# EAGLE design daughter_board10 (EAGLE 7.5.0)

## Sheet 1 of 4
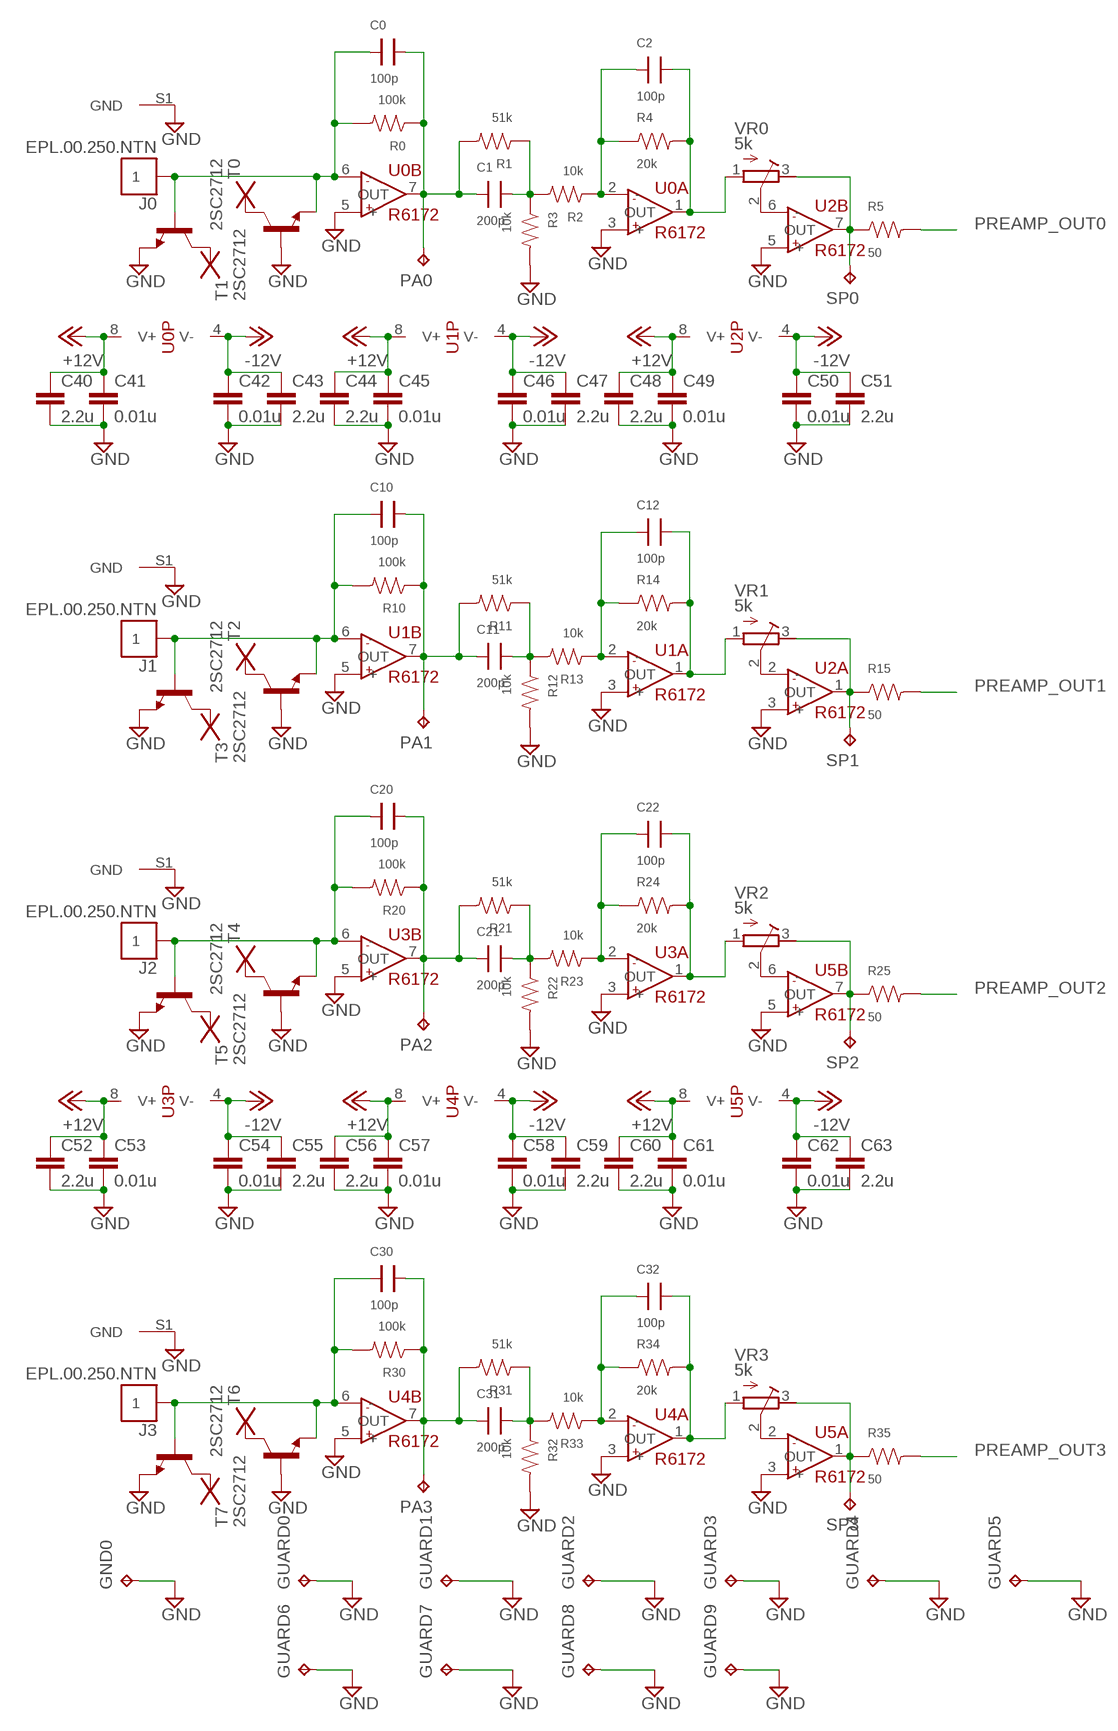
[diagram p0: schematic, sheet 1]

### Parts
C0  100p  C1608  [C0603]
C1  200p  C1608  [C0603]
C2  100p  C1608  [C0603]
C10  100p  C1608  [C0603]
C11  200p  C1608  [C0603]
C12  100p  C1608  [C0603]
C20  100p  C1608  [C0603]
C21  200p  C1608  [C0603]
C22  100p  C1608  [C0603]
C30  100p  C1608  [C0603]
C31  200p  C1608  [C0603]
C32  100p  C1608  [C0603]
C40  2.2u  C-EUC3216  [C3216]
C41  0.01u  C-EUC1608  [C1608]
C42  0.01u  C-EUC1608  [C1608]
C43  2.2u  C-EUC3216  [C3216]
C44  2.2u  C-EUC3216  [C3216]
C45  0.01u  C-EUC1608  [C1608]
C46  0.01u  C-EUC1608  [C1608]
C47  2.2u  C-EUC3216  [C3216]
C48  2.2u  C-EUC3216  [C3216]
C49  0.01u  C-EUC1608  [C1608]
C50  0.01u  C-EUC1608  [C1608]
C51  2.2u  C-EUC3216  [C3216]
C52  2.2u  C-EUC3216  [C3216]
C53  0.01u  C-EUC1608  [C1608]
C54  0.01u  C-EUC1608  [C1608]
C55  2.2u  C-EUC3216  [C3216]
C56  2.2u  C-EUC3216  [C3216]
C57  0.01u  C-EUC1608  [C1608]
C58  0.01u  C-EUC1608  [C1608]
C59  2.2u  C-EUC3216  [C3216]
C60  2.2u  C-EUC3216  [C3216]
C61  0.01u  C-EUC1608  [C1608]
C62  0.01u  C-EUC1608  [C1608]
C63  2.2u  C-EUC3216  [C3216]
GND0  TPPAD1-13  [P1-13]
GUARD0  TPTP17SQ  [TP17SQ]
GUARD1  TPTP17SQ  [TP17SQ]
GUARD2  TPTP17SQ  [TP17SQ]
GUARD3  TPTP17SQ  [TP17SQ]
GUARD4  TPTP17SQ  [TP17SQ]
GUARD5  TPTP17SQ  [TP17SQ]
GUARD6  TPTP17SQ  [TP17SQ]
GUARD7  TPTP17SQ  [TP17SQ]
GUARD8  TPTP17SQ  [TP17SQ]
GUARD9  TPTP17SQ  [TP17SQ]
J0  EPL.00.250.NTN  [EPL.00.250.NTN]
J1  EPL.00.250.NTN  [EPL.00.250.NTN]
J2  EPL.00.250.NTN  [EPL.00.250.NTN]
J3  EPL.00.250.NTN  [EPL.00.250.NTN]
PA0  TPPAD1-13  [P1-13]
PA1  TPPAD1-13  [P1-13]
PA2  TPPAD1-13  [P1-13]
PA3  TPPAD1-13  [P1-13]
R0  100k  R1608  [R0603]
R1  51k  R1608  [R0603]
R2  10k  R1608  [R0603]
R3  10k  R1608  [R0603]
R4  20k  R1608  [R0603]
R5  50  R1608  [R0603]
R10  100k  R1608  [R0603]
R11  51k  R1608  [R0603]
R12  10k  R1608  [R0603]
R13  10k  R1608  [R0603]
R14  20k  R1608  [R0603]
R15  50  R1608  [R0603]
R20  100k  R1608  [R0603]
R21  51k  R1608  [R0603]
R22  10k  R1608  [R0603]
R23  10k  R1608  [R0603]
R24  20k  R1608  [R0603]
R25  50  R1608  [R0603]
R30  100k  R1608  [R0603]
R31  51k  R1608  [R0603]
R32  10k  R1608  [R0603]
R33  10k  R1608  [R0603]
R34  20k  R1608  [R0603]
R35  50  R1608  [R0603]
SP0  TPPAD1-13  [P1-13]
SP1  TPPAD1-13  [P1-13]
SP2  TPPAD1-13  [P1-13]
SP3  TPPAD1-13  [P1-13]
T0  2SC2712  BC808-NPN-SOT23-BEC  [SOT23-BEC]
T1  2SC2712  BC808-NPN-SOT23-BEC  [SOT23-BEC]
T2  2SC2712  BC808-NPN-SOT23-BEC  [SOT23-BEC]
T3  2SC2712  BC808-NPN-SOT23-BEC  [SOT23-BEC]
T4  2SC2712  BC808-NPN-SOT23-BEC  [SOT23-BEC]
T5  2SC2712  BC808-NPN-SOT23-BEC  [SOT23-BEC]
T6  2SC2712  BC808-NPN-SOT23-BEC  [SOT23-BEC]
T7  2SC2712  BC808-NPN-SOT23-BEC  [SOT23-BEC]
U0  R6172  LM6172SOIC(D)8  [SOP8]
U1  R6172  LM6172SOIC(D)8  [SOP8]
U2  R6172  LM6172SOIC(D)8  [SOP8]
U3  R6172  LM6172SOIC(D)8  [SOP8]
U4  R6172  LM6172SOIC(D)8  [SOP8]
U5  R6172  LM6172SOIC(D)8  [SOP8]
U$22  NC  (no package)
U$23  NC  (no package)
U$24  NC  (no package)
U$25  NC  (no package)
U$26  NC  (no package)
U$27  NC  (no package)
U$28  NC  (no package)
U$29  NC  (no package)
VR0  5k  R-TRIMM3296W  [RTRIM3296W]
VR1  5k  R-TRIMM3296W  [RTRIM3296W]
VR2  5k  R-TRIMM3296W  [RTRIM3296W]
VR3  5k  R-TRIMM3296W  [RTRIM3296W]

### Nets
+12V: C40.1 C41.1 C44.1 C45.1 C48.1 C49.1 C52.1 C53.1 C56.1 C57.1 C60.1 C61.1 U0.8(P:V+) U1.8(P:V+) U2.8(P:V+) U3.8(P:V+) U4.8(P:V+) U5.8(P:V+) ; also sheet 2,4
-12V: C42.1 C43.1 C46.1 C47.1 C50.1 C51.1 C54.1 C55.1 C58.1 C59.1 C62.1 C63.1 U0.4(P:V-) U1.4(P:V-) U2.4(P:V-) U3.4(P:V-) U4.4(P:V-) U5.4(P:V-) ; also sheet 2,4
GND: C40.2 C41.2 C42.2 C43.2 C44.2 C45.2 C46.2 C47.2 C48.2 C49.2 C50.2 C51.2 C52.2 C53.2 C54.2 C55.2 C56.2 C57.2 C58.2 C59.2 C60.2 C61.2 C62.2 C63.2 GND0.TP GUARD0.TP GUARD1.TP GUARD2.TP GUARD3.TP GUARD4.TP GUARD5.TP GUARD6.TP GUARD7.TP GUARD8.TP GUARD9.TP J0.S1(GND) J1.S1(GND) J2.S1(GND) J3.S1(GND) R3.2 R12.2 R22.2 R32.2 T0.E T1.B T2.E T3.B T4.E T5.B T6.E T7.B U0.3(A:+) U0.5(B:+) U1.3(A:+) U1.5(B:+) U2.3(A:+) U2.5(B:+) U3.3(A:+) U3.5(B:+) U4.3(A:+) U4.5(B:+) U5.3(A:+) U5.5(B:+) ; also sheet 2,3,4
N$2: C0.1 J0.1 R0.2 T0.B T1.E U0.6(B:-)
N$4: C0.2 C1.1 PA0.TP R0.1 R1.2 U0.7(B:OUT)
N$5: U2.6(B:-) VR0.2(S)
N$6: C1.2 R1.1 R2.2 R3.1
N$7: C2.1 R2.1 R4.1 U0.2(A:-)
N$8: C2.2 R4.2 U0.1(A:OUT) VR0.1(A)
N$9: R5.1 SP0.TP U2.7(B:OUT) VR0.3(E)
N$10: C10.1 J1.1 R10.2 T2.B T3.E U1.6(B:-)
N$11: C10.2 C11.1 PA1.TP R10.1 R11.2 U1.7(B:OUT)
N$12: C11.2 R11.1 R12.1 R13.2
N$13: C12.1 R13.1 R14.1 U1.2(A:-)
N$14: C12.2 R14.2 U1.1(A:OUT) VR1.1(A)
N$17: U2.2(A:-) VR1.2(S)
N$18: R15.1 SP1.TP U2.1(A:OUT) VR1.3(E)
N$20: C20.2 C21.1 PA2.TP R20.1 R21.2 U3.7(B:OUT)
N$21: C21.2 R21.1 R22.1 R23.2
N$22: C22.1 R23.1 R24.1 U3.2(A:-)
N$23: C22.2 R24.2 U3.1(A:OUT) VR2.1(A)
N$24: C20.1 J2.1 R20.2 T4.B T5.E U3.6(B:-)
N$26: U5.6(B:-) VR2.2(S)
N$27: R25.1 SP2.TP U5.7(B:OUT) VR2.3(E)
N$28: C30.1 J3.1 R30.2 T6.B T7.E U4.6(B:-)
N$29: C30.2 C31.1 PA3.TP R30.1 R31.2 U4.7(B:OUT)
N$30: C31.2 R31.1 R32.1 R33.2
N$31: C32.1 R33.1 R34.1 U4.2(A:-)
N$32: C32.2 R34.2 U4.1(A:OUT) VR3.1(A)
N$35: U5.2(A:-) VR3.2(S)
N$36: R35.1 SP3.TP U5.1(A:OUT) VR3.3(E)
N$71: T0.C U$22.NC
N$72: T1.C U$23.NC
N$74: T3.C U$24.NC
N$75: T2.C U$25.NC
N$76: T4.C U$26.NC
N$77: T5.C U$27.NC
N$78: T6.C U$28.NC
N$79: T7.C U$29.NC
PREAMP_OUT0: R5.2 ; also sheet 3
PREAMP_OUT1: R15.2 ; also sheet 3
PREAMP_OUT2: R25.2 ; also sheet 3
PREAMP_OUT3: R35.2 ; also sheet 3

## Sheet 2 of 4
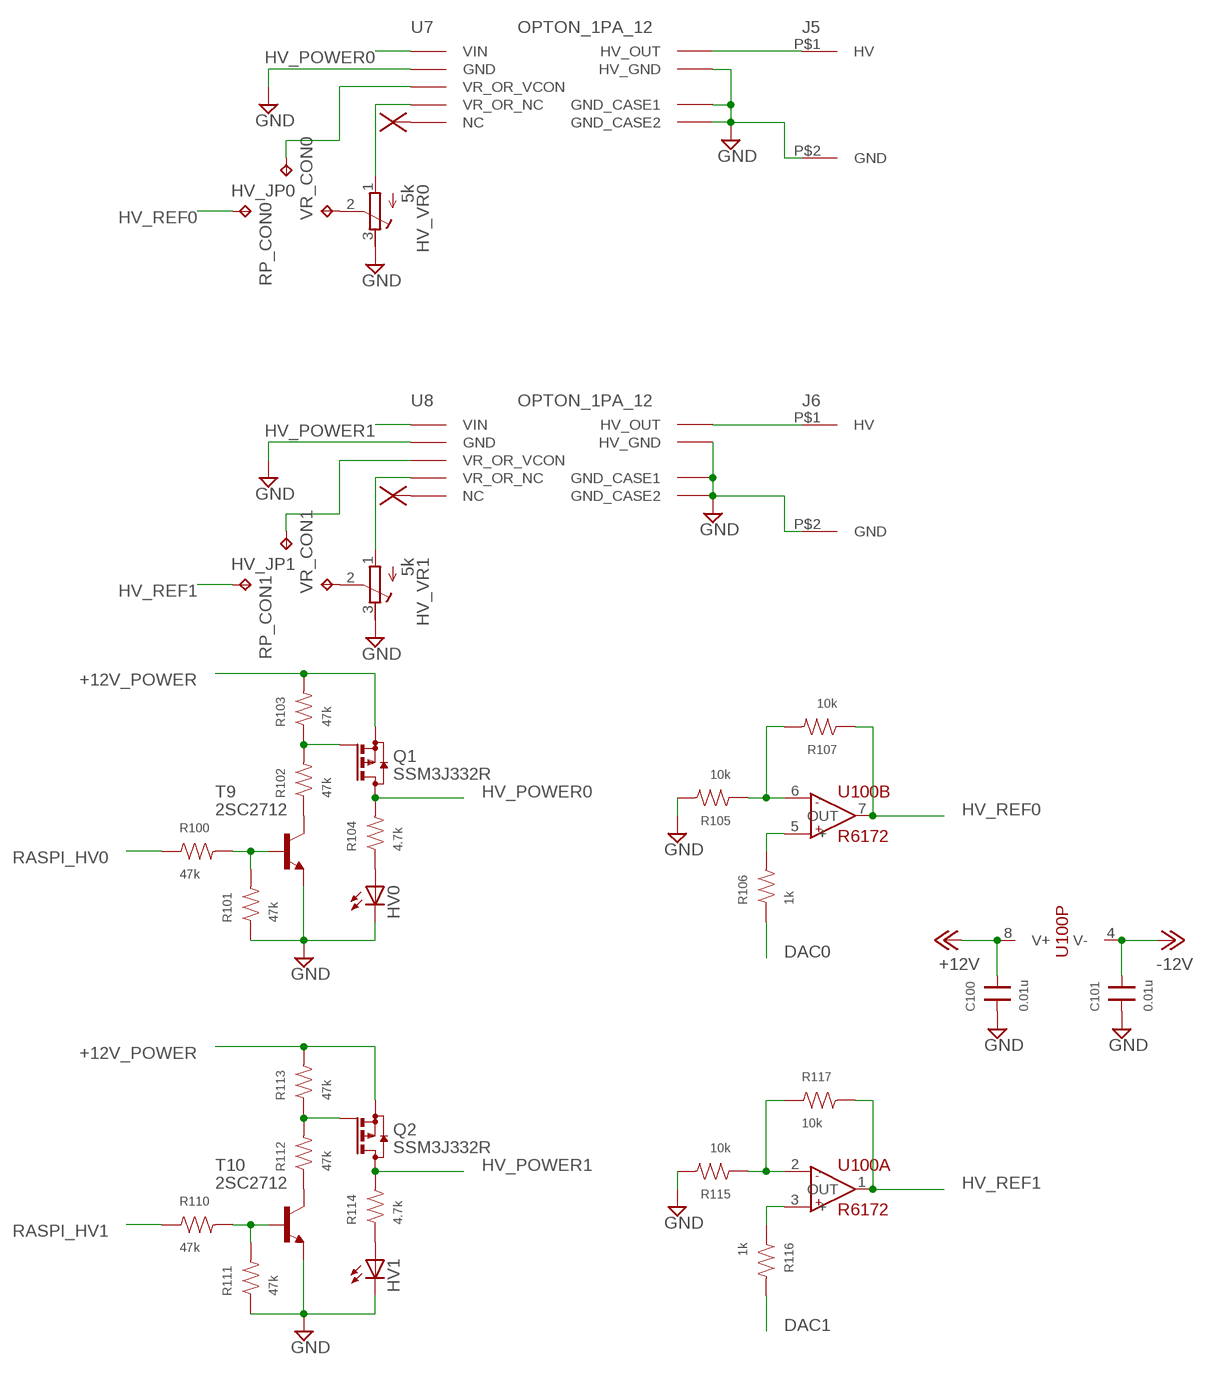
[diagram p1: schematic, sheet 2]

### Parts
C100  0.01u  C1608  [C0603]
C101  0.01u  C1608  [C0603]
HV0  LED_1608  [LED_1608]
HV1  LED_1608  [LED_1608]
HV_JP0  TPPAD1-13  [P1-13]
HV_JP1  TPPAD1-13  [P1-13]
HV_VR0  5k  R-TRIMM3296W  [RTRIM3296W]
HV_VR1  5k  R-TRIMM3296W  [RTRIM3296W]
J5  SHV_PIGTAIL_LAND  [SHV_PIGTAIL_LAND]
J6  SHV_PIGTAIL_LAND  [SHV_PIGTAIL_LAND]
Q1  SSM3J332R  BSS84  [SOT23]
Q2  SSM3J332R  BSS84  [SOT23]
R100  47k  R1608  [R0603]
R101  47k  R1608  [R0603]
R102  47k  R1608  [R0603]
R103  47k  R1608  [R0603]
R104  4.7k  R1608  [R0603]
R105  10k  R1608  [R0603]
R106  1k  R1608  [R0603]
R107  10k  R1608  [R0603]
R110  47k  R1608  [R0603]
R111  47k  R1608  [R0603]
R112  47k  R1608  [R0603]
R113  47k  R1608  [R0603]
R114  4.7k  R1608  [R0603]
R115  10k  R1608  [R0603]
R116  1k  R1608  [R0603]
R117  10k  R1608  [R0603]
RP_CON0  TPPAD1-13  [P1-13]
RP_CON1  TPPAD1-13  [P1-13]
T9  2SC2712  BC808-NPN-SOT23-BEC  [SOT23-BEC]
T10  2SC2712  BC808-NPN-SOT23-BEC  [SOT23-BEC]
U7  OPTON_1PA_12  [OPTON_PA]
U8  OPTON_1PA_12  [OPTON_PA]
U100  R6172  LM6172SOIC(D)8  [SOP8]
U$6  NC  (no package)
U$9  NC  (no package)
VR_CON0  TPPAD1-13  [P1-13]
VR_CON1  TPPAD1-13  [P1-13]

### Nets
+12V: C100.2 U100.8(P:V+) ; also sheet 1,4
+12V_POWER: Q1.2(S) Q2.2(S) R103.2 R113.2 ; also sheet 3,4
-12V: C101.2 U100.4(P:V-) ; also sheet 1,4
DAC0: R106.1 ; also sheet 3
DAC1: R116.2 ; also sheet 3
GND: C100.1 C101.1 HV0.P$2(C) HV1.P$2(C) HV_VR0.3(E) HV_VR1.3(E) J5.P$2(GND) J6.P$2(GND) R101.1 R105.2 R111.1 R115.2 T9.E T10.E U7.P$2(GND) U7.P$6(HV_GND) U7.P$8(GND_CASE1) U7.P$9(GND_CASE2) U8.P$2(GND) U8.P$6(HV_GND) U8.P$8(GND_CASE1) U8.P$9(GND_CASE2) ; also sheet 1,3,4
HV_POWER0: Q1.3(D) R104.2 U7.P$1(VIN)
HV_POWER1: Q2.3(D) R114.2 U8.P$1(VIN)
HV_REF0: R107.1 RP_CON0.TP U100.7(B:OUT)
HV_REF1: R117.2 RP_CON1.TP U100.1(A:OUT)
N$37: R102.1 T9.C
N$38: Q1.1(G) R102.2 R103.1
N$39: R100.2 R101.2 T9.B
N$40: R112.1 T10.C
N$41: Q2.1(G) R112.2 R113.1
N$42: HV0.P$1(A) R104.1
N$43: R110.2 R111.2 T10.B
N$44: HV1.P$1(A) R114.1
N$45: R105.1 R107.2 U100.6(B:-)
N$46: J5.P$1(HV) U7.P$7(HV_OUT)
N$47: R106.2 U100.5(B:+)
N$48: J6.P$1(HV) U8.P$7(HV_OUT)
N$49: R115.1 R117.1 U100.2(A:-)
N$50: R116.1 U100.3(A:+)
N$55: HV_VR0.1(A) U7.P$4(VR_OR_NC)
N$56: U7.P$5(NC) U$6.NC
N$57: HV_VR1.2(S) VR_CON1.TP
N$59: U8.P$5(NC) U$9.NC
N$69: HV_VR0.2(S) VR_CON0.TP
N$73: HV_VR1.1(A) U8.P$4(VR_OR_NC)
RASPI_HV0: R100.1 ; also sheet 3
RASPI_HV1: R110.1 ; also sheet 3
TP1: HV_JP0.TP U7.P$3(VR_OR_VCON)
TP2: HV_JP1.TP U8.P$3(VR_OR_VCON)

## Sheet 3 of 4
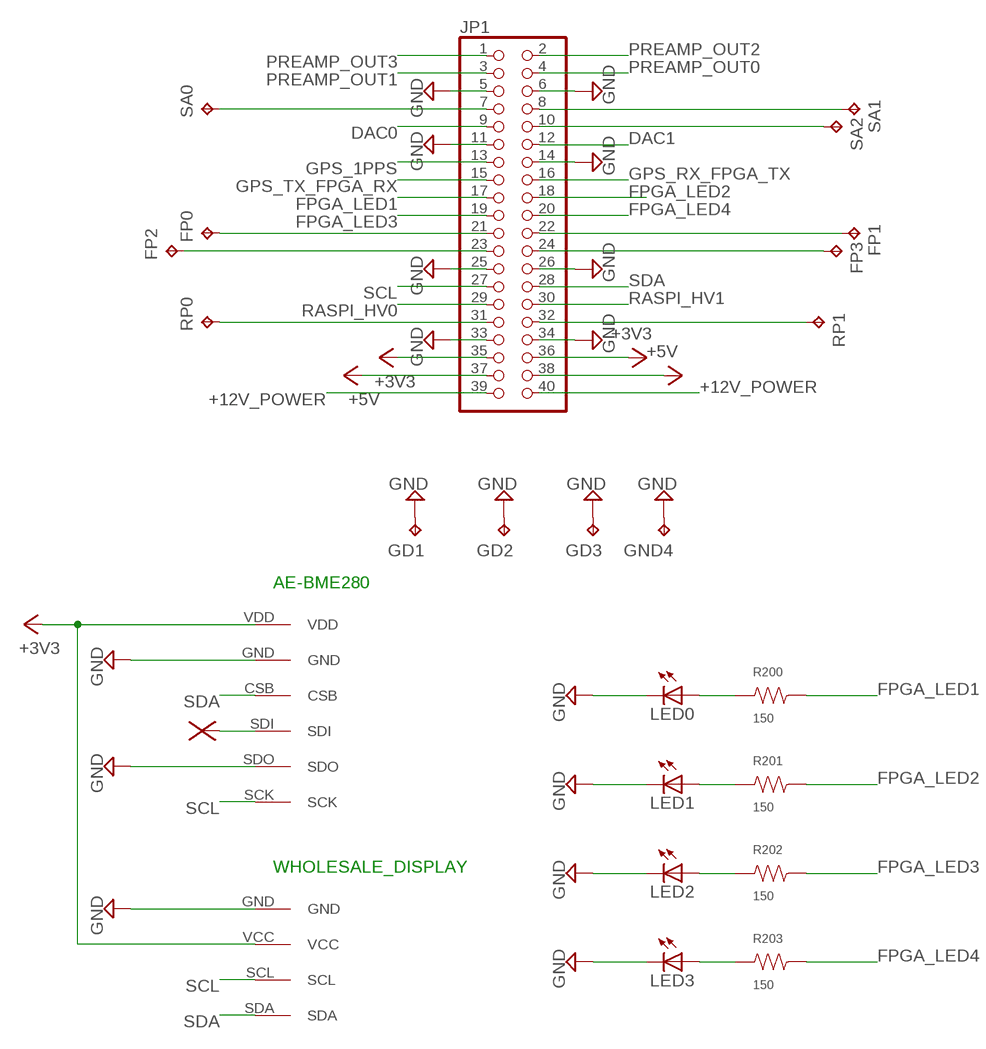
[diagram p2: schematic, sheet 3]

### Parts
FP0  TPPAD1-13  [P1-13]
FP1  TPPAD1-13  [P1-13]
FP2  TPPAD1-13  [P1-13]
FP3  TPPAD1-13  [P1-13]
GD1  TPPAD1-13  [P1-13]
GD2  TPPAD1-13  [P1-13]
GD3  TPPAD1-13  [P1-13]
GND4  TPPAD1-13  [P1-13]
JP1  PINHD-2X20  [2X20]
LED0  LED_1608  [LED_1608]
LED1  LED_1608  [LED_1608]
LED2  LED_1608  [LED_1608]
LED3  LED_1608  [LED_1608]
R200  150  R1608  [R0603]
R201  150  R1608  [R0603]
R202  150  R1608  [R0603]
R203  150  R1608  [R0603]
RP0  TPPAD1-13  [P1-13]
RP1  TPPAD1-13  [P1-13]
SA0  TPPAD1-13  [P1-13]
SA1  TPPAD1-13  [P1-13]
SA2  TPPAD1-13  [P1-13]
U$1  WHOLESALE_DISPLAY  [WHOLESALE_DISPLAY]
U$2  AE-BME280  [AE-BME280]
U$17  NC  (no package)

### Nets
+3V3: JP1.35 JP1.36 U$1.VCC U$2.VDD ; also sheet 4
+5V: JP1.37 JP1.38
+12V_POWER: JP1.39 JP1.40 ; also sheet 2,4
DAC0: JP1.9 ; also sheet 2
DAC1: JP1.12 ; also sheet 2
FPGA_LED1: JP1.17 R200.2
FPGA_LED2: JP1.18 R201.2
FPGA_LED3: JP1.19 R202.2
FPGA_LED4: JP1.20 R203.2
GND: GD1.TP GD2.TP GD3.TP GND4.TP JP1.5 JP1.6 JP1.11 JP1.14 JP1.25 JP1.26 JP1.33 JP1.34 LED0.P$2(C) LED1.P$2(C) LED2.P$2(C) LED3.P$2(C) U$1.GND U$2.GND U$2.SDO ; also sheet 1,2,4
GPS_1PPS: JP1.13 ; also sheet 4
GPS_RX_FPGA_TX: JP1.16 ; also sheet 4
GPS_TX_FPGA_RX: JP1.15 ; also sheet 4
LED0: LED0.P$1(A) R200.1
N$3: JP1.31 RP0.TP
N$15: FP2.TP JP1.23
N$16: FP0.TP JP1.21
N$19: JP1.7 SA0.TP
N$25: JP1.8 SA1.TP
N$33: JP1.10 SA2.TP
N$34: FP1.TP JP1.22
N$51: U$2.SDI U$17.NC
N$58: FP3.TP JP1.24
N$66: LED3.P$1(A) R203.1
N$67: LED2.P$1(A) R202.1
N$68: LED1.P$1(A) R201.1
N$70: JP1.32 RP1.TP
PREAMP_OUT0: JP1.4 ; also sheet 1
PREAMP_OUT1: JP1.3 ; also sheet 1
PREAMP_OUT2: JP1.2 ; also sheet 1
PREAMP_OUT3: JP1.1 ; also sheet 1
RASPI_HV0: JP1.29 ; also sheet 2
RASPI_HV1: JP1.30 ; also sheet 2
SCL: JP1.27 U$1.SCL U$2.SCK
SDA: JP1.28 U$1.SDA U$2.CSB

### Notes on the sheet
- AE-BME280
- WHOLESALE_DISPLAY

## Sheet 4 of 4
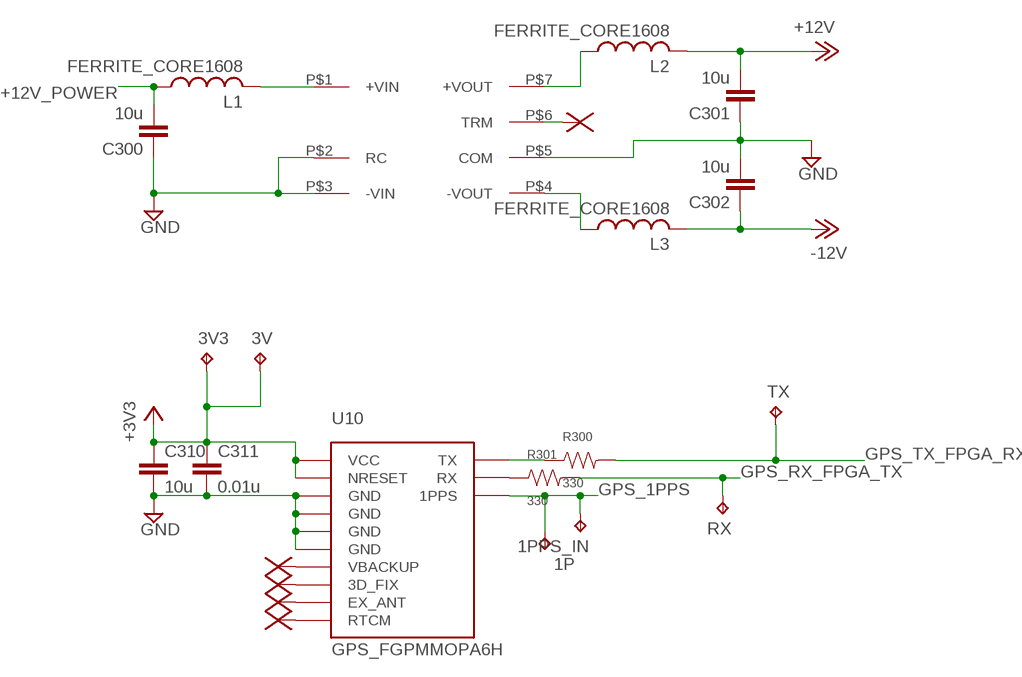
[diagram p3: schematic, sheet 4]

### Parts
1P  TPPAD1-13  [P1-13]
1PPS_IN  TPPAD1-13  [P1-13]
3V  TPPAD1-13  [P1-13]
3V3  TPPAD1-13  [P1-13]
C300  10u  C-EUC3216  [C3216]
C301  10u  C-EUC3216  [C3216]
C302  10u  C-EUC3216  [C3216]
C310  10u  C-EUC3216  [C3216]
C311  0.01u  C-EUC1608  [C1608]
L1  FERRITE_CORE1608  [R0603]
L2  FERRITE_CORE1608  [R0603]
L3  FERRITE_CORE1608  [R0603]
R300  330  R1608  [R0603]
R301  330  R1608  [R0603]
RX  TPPAD1-13  [P1-13]
TX  TPPAD1-13  [P1-13]
U10  GPS_FGPMMOPA6H  [GPS_FGPMMOPA6H]
U$4  CC6-SERIES  [CC6-SERIES]
U$18  NC  (no package)
U$19  NC  (no package)
U$20  NC  (no package)
U$21  NC  (no package)
U$30  NC  (no package)

### Nets
+3V3: 3V3.TP 3V.TP C310.1 C311.1 U10.P$1(VCC) U10.P$2(NRESET) ; also sheet 3
+12V: C301.2 L2.2 ; also sheet 1,2
+12V_POWER: C300.2 L1.1 ; also sheet 2,3
-12V: C302.1 L3.2 ; also sheet 1,2
GND: C300.1 C301.1 C302.2 C310.2 C311.2 U10.P$3(GND) U10.P$8(GND) U10.P$12(GND) U10.P$19(GND) U$4.P$2(RC) U$4.P$3(-VIN) U$4.P$5(COM) ; also sheet 1,2,3
GPS_1PPS: 1P.TP 1PPS_IN.TP U10.P$13(1PPS) ; also sheet 3
GPS_RX_FPGA_TX: R301.2 RX.TP ; also sheet 3
GPS_TX_FPGA_RX: R300.2 TX.TP ; also sheet 3
N$1: U$4.P$6(TRM) U$30.NC
N$52: L2.1 U$4.P$7(+VOUT)
N$53: L3.1 U$4.P$4(-VOUT)
N$54: L1.2 U$4.P$1(+VIN)
N$60: U10.P$4(VBACKUP) U$18.NC
N$61: U10.P$5(3D_FIX) U$19.NC
N$62: U10.P$11(EX_ANT) U$20.NC
N$63: U10.P$14(RTCM) U$21.NC
N$64: R301.1 U10.P$10(RX)
N$65: R300.1 U10.P$9(TX)

## Library data of the parts
1P 1PPS_IN 3V 3V3 FP0 FP1-FP3 GD1-GD3 GND0 GND4 GUARD0 GUARD1-GUARD9 HV_JP0 HV_JP1 PA0 PA1-PA3 RP0 RP1 RP_CON0 RP_CON1 RX SA0 SA1 SA2 SP0 SP1-SP3 TX VR_CON0 VR_CON1 = Aardvark:TP: Test pad
C0 C1 C2 C10-C12 C20-C22 C30-C32 C100 C101 = Aardvark:C1608: SMC Capacitor 1608 (0603)
C40-C63 = resistor:C-EU: CAPACITOR, European symbol
C300-C302 C310 C311 = rcl:C-EU: CAPACITOR, European symbol
HV0 HV1 LED0 LED1-LED3 = Aardvark:LED_1608: SMD LED datasheet <http://docs-asia.electrocomponents.com/webdocs/1020/0900766b81020b31.pdf> -------------------------- 色: V 1608 SML-310VTT86 (Vf=2.0V I_F=20mA) RS: 700-7926 <http://jp.rs-online.com/web/p/visible-leds/7007926/> 15円/個 20個単位 -------------------------- 色: 黄色 SML-311WTT86 (Vf=1.8 I_F=2mA) RS: 752-6789 <http://jp.rs-online.com/web/p/visible-leds/7526789/> 11.5円/個 10個単位
HV_VR0 HV_VR1 VR0 VR1-VR3 = resistor:R-TRIMM: Trimm resistor
J0 J1-J3 = Aardvark:EPL.00.250.NTN: LEMO Connector Elbow receptacle for printed circuit Source: http://intra.lemo.ch/catalog/ROW/UK_English/00and01Coaxial_en.pdf RS: Right angle: http://jp.rs-online.com/web/p/coaxial-plugs-sockets/1248635/ Straight1: http://jp.rs-online.com/web/p/coaxial-plugs-sockets/1243371/ Straight2: http://jp.rs-online.com/web/p/coaxial-plugs-sockets/1248629/; MPN: EPL.00.250.NTN; OC_FARNELL: 3817866; OC_NEWARK: 25R7486; PACKAGE: Through Hole; SUPPLIER: LEMO
J5 J6 = Aardvark:SHV_PIGTAIL_LAND
JP1 = Aardvark:PINHD-2X20: PIN HEADER
L1-L3 = Aardvark:FERRITE_CORE1608
Q1 Q2 = transistor-small-signal:BSS84: P-CHANNEL MOS FET
R0 R1-R5 R10-R15 R20-R25 R30-R35 R100-R107 R110-R117 R200-R203 R300 R301 = Aardvark:R1608: SMD Resistor 1608 (0603)
T0 T1-T7 = transistor-neu-to92:*-NPN-: NPN Transistror BF959 corrected 2008.03.06
T9 T10 = transistor:*-NPN-: NPN Transistror BF959 corrected 2008.03.06
U0 U1-U5 U100 = OPA:LM6172: TEXAS INSTRUMENTS Dual High Speed, Low Power, Low Distortion, Voltage Feedback Amplifier LM6172 <http://www.ti.com/lit/ds/symlink/lm6172.pdf>
U7 U8 = Aardvark:OPTON_1PA_12
U10 = Aardvark:GPS_FGPMMOPA6H: GPS FGPMMOPA6H MT3339 TTL -165dBm Integration Of Antenna Module https://www.adafruit.com/datasheets/GlobalTop-FGPMMOPA6H-Datasheet-V0A.pdf
U$1 = Aardvark:WHOLESALE_DISPLAY
U$2 = Aardvark:AE-BME280
U$4 = Aardvark:CC6-SERIES: DC-DC コンバータ CC6-xxxxxR-E シリーズ
U$6 U$9 U$17-U$30 = Aardvark:NC

## Board
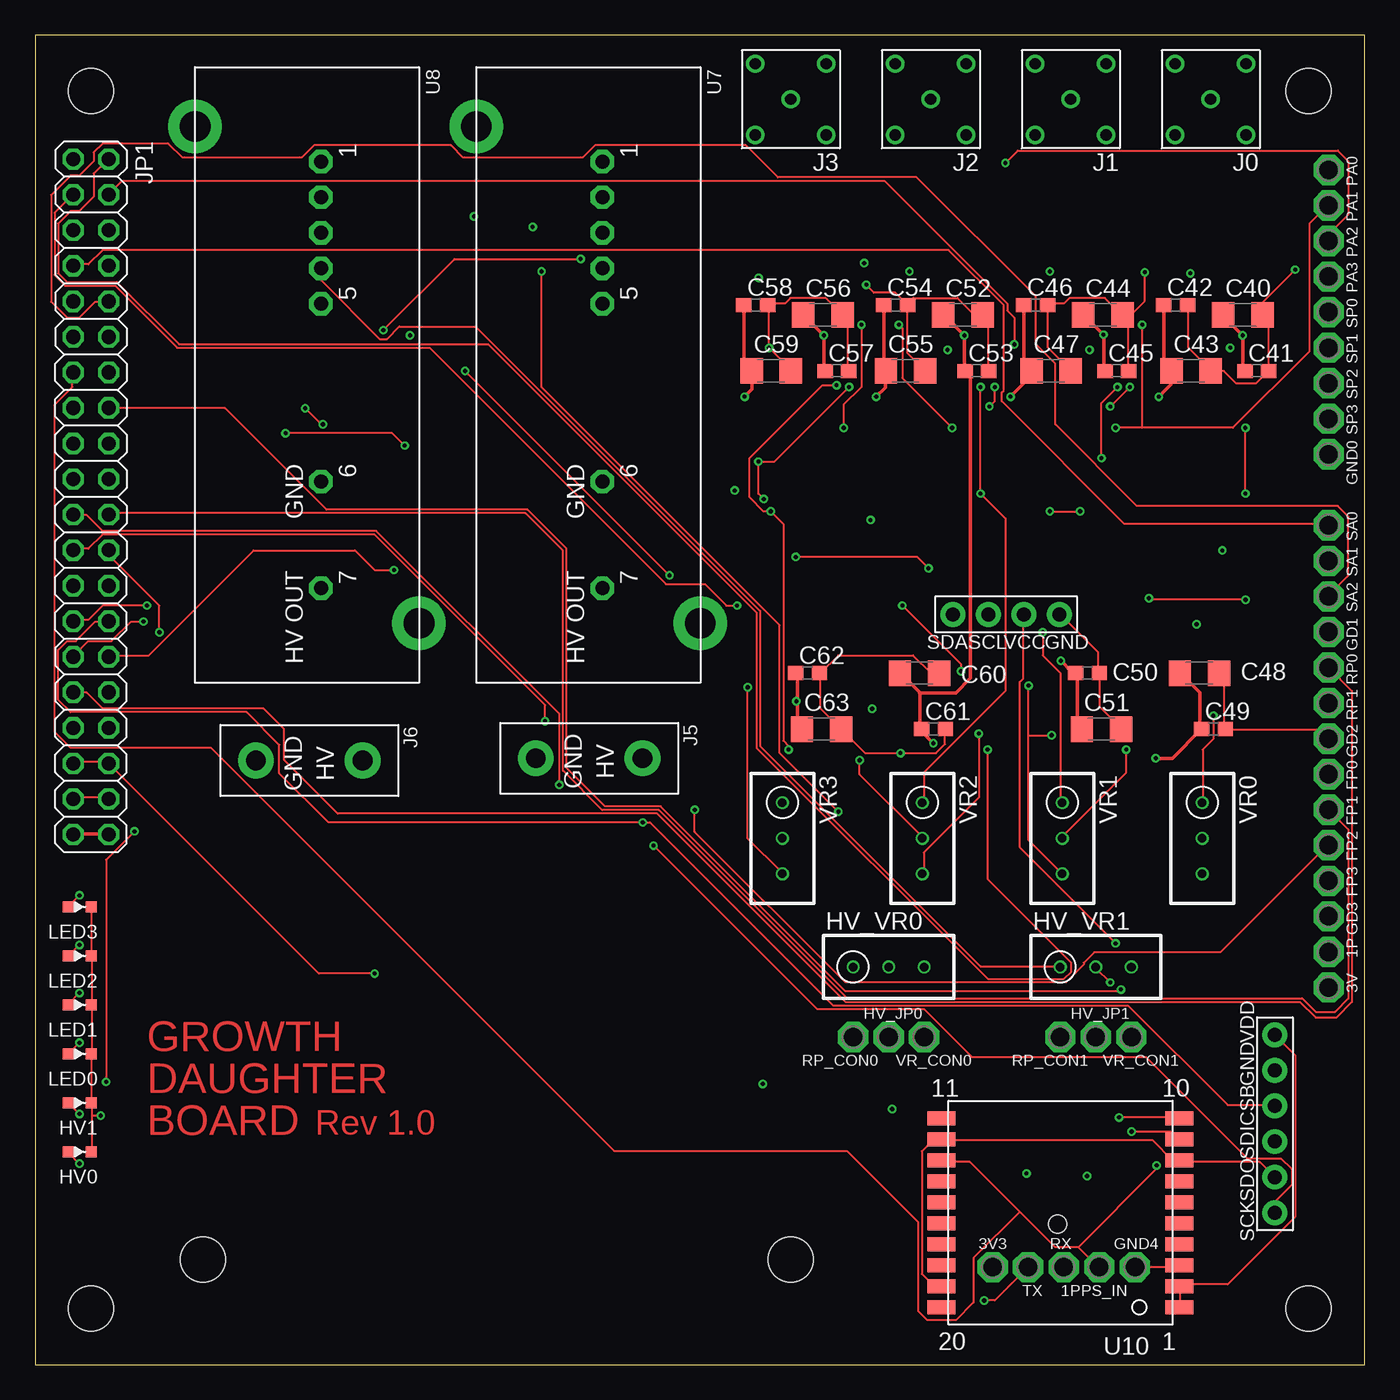
[diagram p4: board, top side]
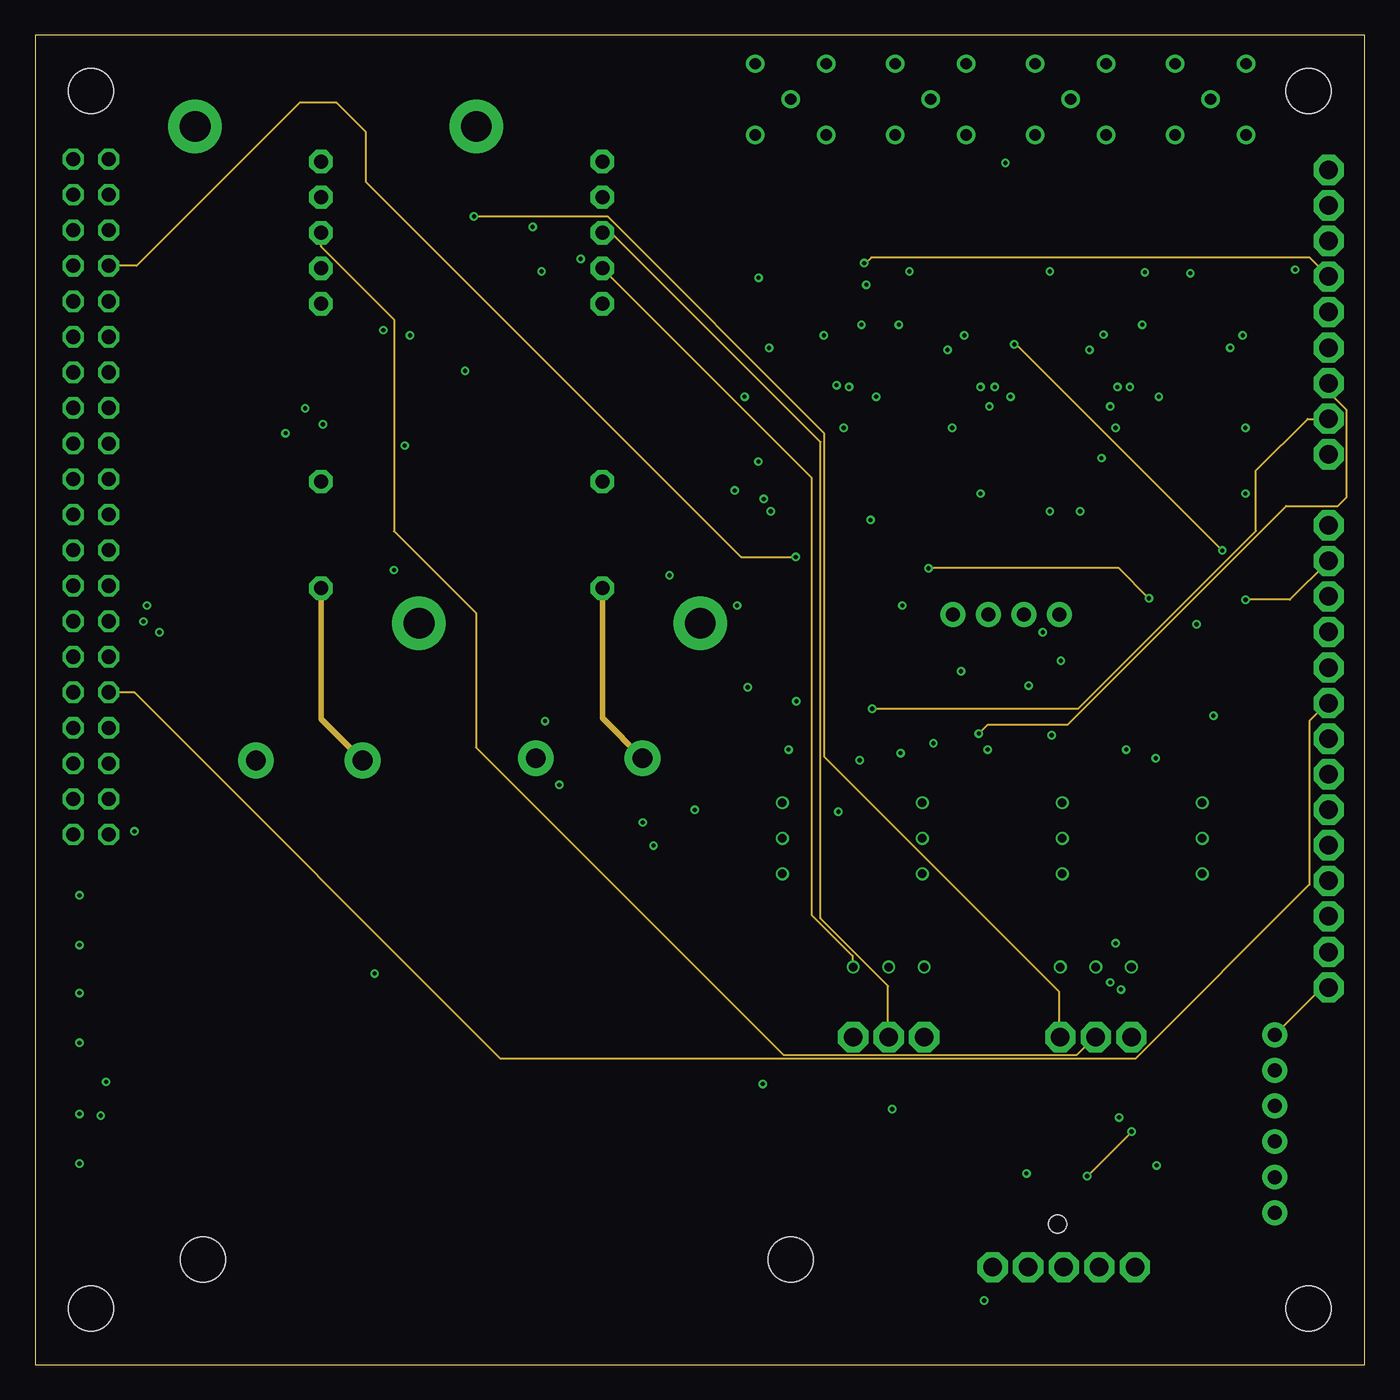
[diagram p5: board, inner layer Route2]
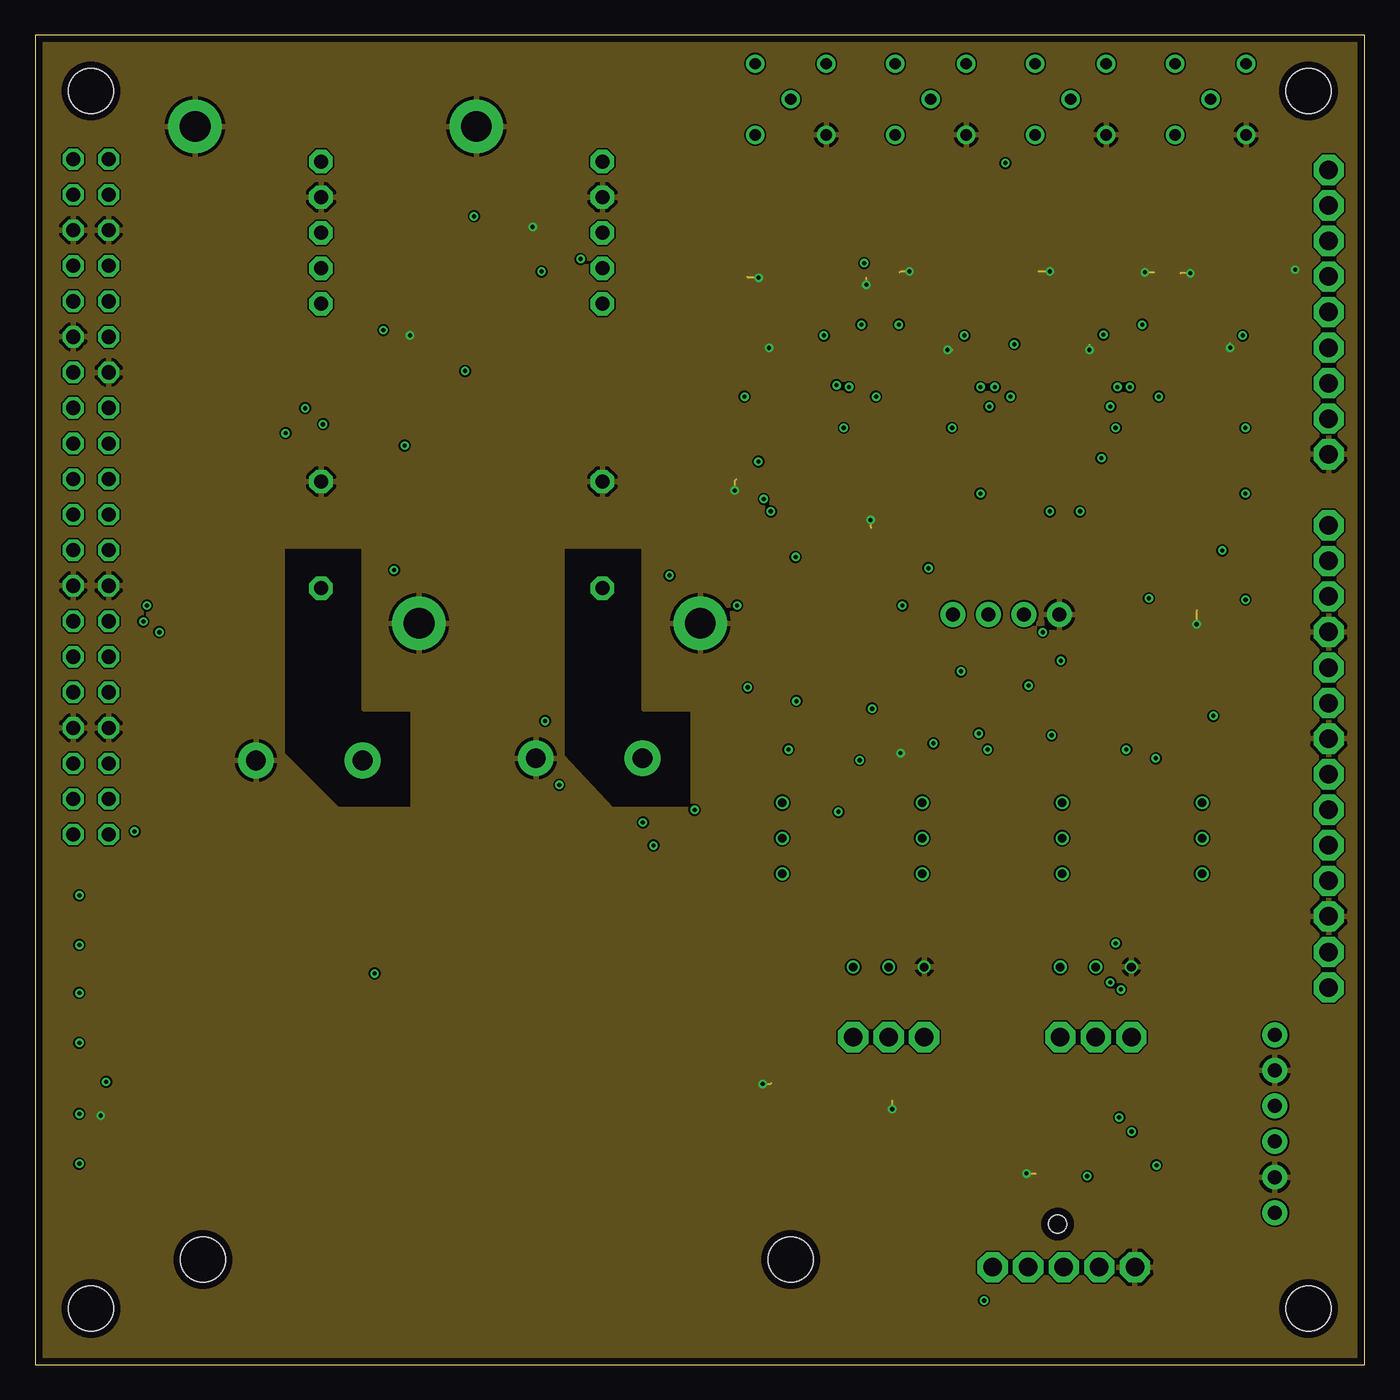
[diagram p6: board, inner layer Route15]
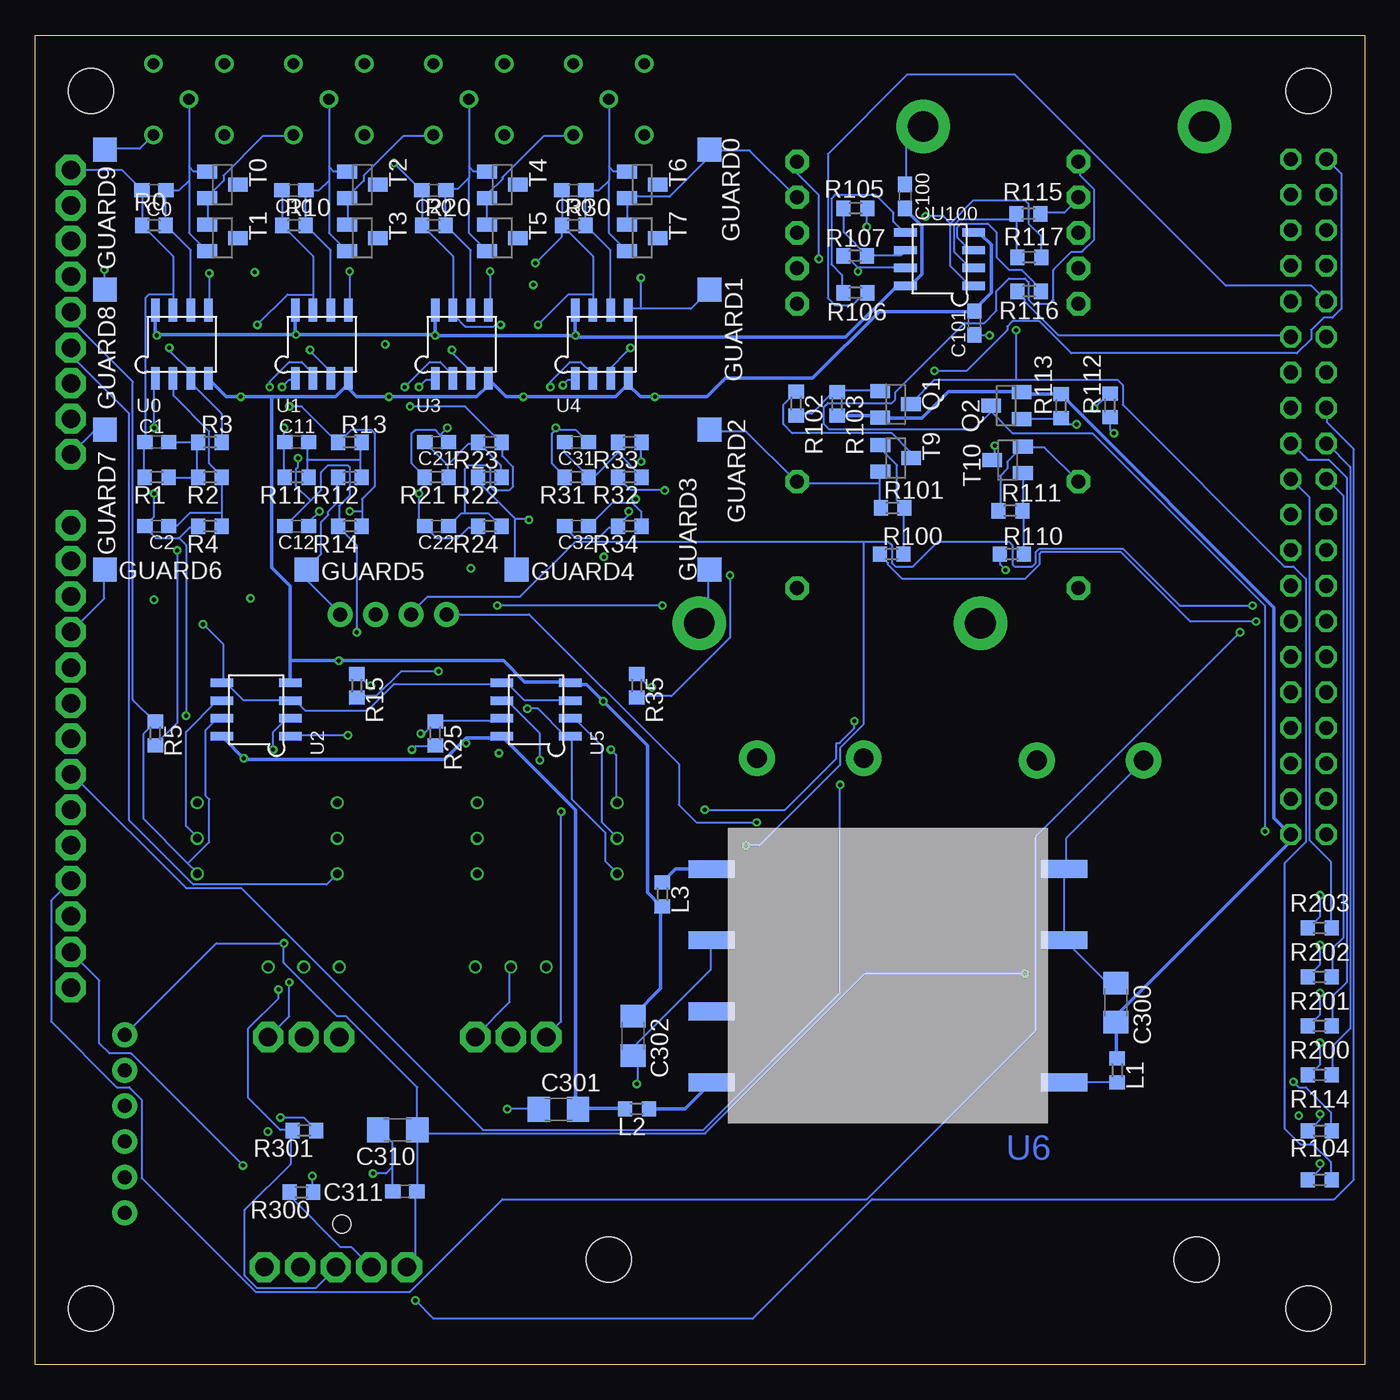
[diagram p7: board, bottom side, seen from below]

Size 95 x 95 mm. Coordinates in mm from the lower left corner, seen from the top.
Outline: 0,0 95,0 95,95 0,95 0,0
Copper layers (1+2*15+16): Top 0.018mm / dielectric 0.25mm / Route2 0.035mm / dielectric 1mm / Route15 0.035mm / dielectric 0.25mm / Bottom 0.018mm
Design rules "pban_5mil-l4": minimum track width 5mil, minimum drill 0.3mm, track to track 5mil, track to pad 0.229mm, pad to pad 5mil, via to via 5mil, smd to smd 5mil, copper to edge 0.5mm, drill to drill 0.5mm, minimum pad ring 0.15mm, minimum via ring 0.15mm, stop-mask expansion 4mil, vias tented up to drill 0.35mm, thermal gap 10mil
Holes 3.2 mm at 4,4 91,91 91,4 4,91 54,7.5 12,7.5
tRestrict: area 8,0 to 58,15
bRestrict: area 8,3.5 to 16,11.5; area 50,3.5 to 58,11.5

### Footprints (pad centres in the part's own frame; a part is rotated, then mirrored left to right if it is on the bottom)
P1-13 = drill 1.321 pad 2.159 octagon: TP 0,0
C0603 = smd 1.1 x 1: 1 -0.85,0; 2 0.85,0
C3216 = smd 1.6 x 1.8: 1 -1.4,0; 2 1.4,0
C1608 = smd 1.1 x 1: 1 -0.85,0; 2 0.85,0
TP17SQ = smd 1.7 x 1.7: TP 0,0
LED_1608 = smd 0.8 x 0.8: P$1 0,0.825; P$2 0,-0.825
RTRIM3296W = drill 0.61: 1 0,-2.54; 2 0,0; 3 0,2.54
EPL.00.250.NTN = drill 0.8 pad 1.3: 1 0,0; S1 -2.54,2.54; S2 -2.54,-2.54; S3 2.54,-2.54; S4 2.54,2.54
SHV_PIGTAIL_LAND = drill 1.4 pad 2.54: P$1 0,3.81; P$2 0,-3.81
2X20 = drill 1.016 octagon: 1 -24.13,-1.27; 2 -24.13,1.27; 3 -21.59,-1.27; 4 -21.59,1.27; 5 -19.05,-1.27; 6 -19.05,1.27; 7 -16.51,-1.27; 8 -16.51,1.27; 9 -13.97,-1.27; 10 -13.97,1.27; 11 -11.43,-1.27; 12 -11.43,1.27; 13 -8.89,-1.27; 14 -8.89,1.27; 15 -6.35,-1.27; 16 -6.35,1.27; 17 -3.81,-1.27; 18 -3.81,1.27; 19 -1.27,-1.27; 20 -1.27,1.27; 21 1.27,-1.27; 22 1.27,1.27; 23 3.81,-1.27; 24 3.81,1.27; 25 6.35,-1.27; 26 6.35,1.27; 27 8.89,-1.27; 28 8.89,1.27; 29 11.43,-1.27; 30 11.43,1.27; 31 13.97,-1.27; 32 13.97,1.27; 33 16.51,-1.27; 34 16.51,1.27; 35 19.05,-1.27; 36 19.05,1.27; 37 21.59,-1.27; 38 21.59,1.27; 39 24.13,-1.27; 40 24.13,1.27
R0603 = smd 1 x 1.1: 1 -0.85,0; 2 0.85,0
SOT23 = smd 1 x 1.4: 1 -0.95,-1.1; 2 0.95,-1.1; 3 0,1.1
SOT23-BEC = smd 1 x 1.4: B -0.95,-1.1; C 0,1.1; E 0.95,-1.1
SOP8 = smd 0.6 x 1.62: 1 -1.905,-2.44; 2 -0.635,-2.44; 3 0.635,-2.44; 4 1.905,-2.44; 5 1.905,2.44; 6 0.635,2.44; 7 -0.635,2.44; 8 -1.905,2.44
OPTON_PA = drill 1 pad 1.676 octagon: P$1 -15.24,0; P$2 -12.7,0; P$3 -10.16,0; P$4 -7.62,0; P$5 -5.08,0; P$6 7.62,0; P$7 15.24,0 | drill 2.2 pad 3.81: P$8 17.75,7; P$9 -17.75,-9
GPS_FGPMMOPA6H = smd 2 x 1: P$1 -8.508,6.75; P$2 -8.508,5.25; P$3 -8.508,3.75; P$4 -8.508,2.25; P$5 -8.508,0.75; P$6 -8.508,-0.75; P$7 -8.508,-2.25; P$8 -8.508,-3.75; P$9 -8.508,-5.25; P$10 -8.508,-6.75; P$11 8.508,-6.75; P$12 8.508,-5.25; P$13 8.508,-3.75; P$14 8.508,-2.25; P$15 8.508,-0.75; P$16 8.508,0.75; P$17 8.508,2.25; P$18 8.508,3.75; P$19 8.508,5.25; P$20 8.508,6.75 | hole 1.3: 0.2,0.8
WHOLESALE_DISPLAY = drill 1 pad 1.778: GND 3.81,0; SCL -1.27,0; SDA -3.81,0; VCC 1.27,0
AE-BME280 = drill 1 pad 1.778: CSB -1.27,0; GND -3.81,0; SCK 6.35,0; SDI 1.27,0; SDO 3.81,0; VDD -6.35,0
CC6-SERIES = smd 3.302 x 1.27: P$1 -1.169,18.17; P$2 -1.169,8.01; P$3 -1.169,2.921; P$4 24.029,2.93; P$5 24.029,8.01; P$6 24.029,13.09; P$7 24.029,18.17

### Placement (x,y rotation side)
1P  92.44,29.48 270 top
1PPS_IN  76.05,6.95 180 top
3V  92.44,26.94 270 top
3V3  68.43,6.95 0 top
C0  86.5,83.9 180 bottom
C1  86.3,65.9 0 bottom
C2  86.3,59.9 180 bottom
C10  76.5,83.9 180 bottom
C11  76.3,65.9 0 bottom
C12  76.3,59.9 180 bottom
C20  66.5,83.9 180 bottom
C21  66.3,65.9 180 bottom
C22  66.3,59.9 180 bottom
C30  56.5,83.9 180 bottom
C31  56.3,65.9 180 bottom
C32  56.3,59.9 180 bottom
C40  86.3,75 0 top
C41  87.3,71 0 top
C42  81.5,75.7 0 top
C43  82.6,71 0 top
C44  76.3,75 0 top
C45  77.3,71 0 top
C46  71.5,75.7 0 top
C47  72.6,71 0 top
C48  83.2,49.4 0 top
C49  84.2,45.4 0 top
C50  75.2,49.4 0 top
C51  76.2,45.4 0 top
C52  66.3,75 0 top
C53  67.3,71 0 top
C54  61.5,75.7 0 top
C55  62.2,71 0 top
C56  56.3,75 0 top
C57  57.3,71 0 top
C58  51.5,75.7 0 top
C59  52.6,71 0 top
C60  63.2,49.4 0 top
C61  64.2,45.4 0 top
C62  55.2,49.4 0 top
C63  56.2,45.4 0 top
C100  32.83,83.47 270 bottom
C101  27.87,74.42 90 bottom
C300  17.77,25.86 270 bottom
C301  57.6,18.23 0 bottom
C302  52.27,23.48 270 bottom
C310  69.08,16.77 180 bottom
C311  68.57,12.38 180 bottom
FP0  92.44,42.18 270 top
FP1  92.44,39.64 270 top
FP2  92.44,37.1 270 top
FP3  92.44,34.56 270 top
GD1  92.44,52.34 270 top
GD2  92.44,44.72 270 top
GD3  92.44,32.02 270 top
GND0  92.44,65.04 270 top
GND4  78.59,6.95 0 top
GUARD0  46.8,86.8 270 bottom
GUARD1  46.8,76.8 270 bottom
GUARD2  46.8,66.8 270 bottom
GUARD3  46.8,56.8 90 bottom
GUARD4  60.6,56.8 180 bottom
GUARD5  75.6,56.8 180 bottom
GUARD6  90,56.8 0 bottom
GUARD7  90,66.8 270 bottom
GUARD8  90,76.8 270 bottom
GUARD9  90,86.8 270 bottom
HV0  3.2,15.2 90 top
HV1  3.2,18.7 90 top
HV_JP0  61,23.4 0 top
HV_JP1  75.8,23.4 0 top
HV_VR0  61,28.4 270 top
HV_VR1  75.8,28.4 270 top
J0  84,90.4 180 top
J1  74,90.4 180 top
J2  64,90.4 180 top
J3  54,90.4 180 top
J5  39.6,43.31 270 top
J6  19.6,43.16 270 top
JP1  4,62 270 top
L1  17.67,21.02 270 bottom
L2  51.99,18.27 180 bottom
L3  50.17,33.6 270 bottom
LED0  3.2,22.2 90 top
LED1  3.2,25.7 90 top
LED2  3.2,29.2 90 top
LED3  3.2,32.7 90 top
PA0  92.44,85.36 270 top
PA1  92.44,82.82 270 top
PA2  92.44,80.28 270 top
PA3  92.44,77.74 270 top
Q1  33.51,68.61 270 bottom
Q2  25.59,68.52 90 bottom
R0  86.5,81.4 0 bottom
R1  86.3,63.4 180 bottom
R2  82.5,63.4 180 bottom
R3  82.5,65.9 0 bottom
R4  82.5,59.9 180 bottom
R5  86.4,45.1 270 bottom
R10  76.5,81.4 0 bottom
R11  76.3,63.4 180 bottom
R12  72.5,63.4 180 bottom
R13  72.5,65.9 0 bottom
R14  72.5,59.9 180 bottom
R15  72,48.5 270 bottom
R20  66.5,81.4 0 bottom
R21  66.3,63.4 180 bottom
R22  62.5,63.4 180 bottom
R23  62.5,65.9 180 bottom
R24  62.5,59.9 180 bottom
R25  66.4,45.1 270 bottom
R30  56.5,81.4 0 bottom
R31  56.3,63.4 180 bottom
R32  52.5,63.4 180 bottom
R33  52.5,65.9 180 bottom
R34  52.5,59.9 180 bottom
R35  52,48.5 270 bottom
R100  33.79,57.91 0 bottom
R101  33.71,61.21 0 bottom
R102  40.61,68.67 270 bottom
R103  37.69,68.65 270 bottom
R104  3.2,13.2 0 bottom
R105  36.37,82.62 0 bottom
R106  36.37,76.58 180 bottom
R107  36.39,79.22 0 bottom
R110  25.19,57.91 0 bottom
R111  25.31,61.01 0 bottom
R112  18.19,68.53 90 bottom
R113  21.68,68.49 90 bottom
R114  3.2,16.7 0 bottom
R115  24.01,82.22 0 bottom
R116  23.97,76.68 180 bottom
R117  23.95,79.12 0 bottom
R200  3.2,20.7 0 bottom
R201  3.2,24.2 0 bottom
R202  3.2,27.7 0 bottom
R203  3.2,31.2 0 bottom
R300  75.97,12.32 180 bottom
R301  75.75,16.72 180 bottom
RP0  92.44,49.8 270 top
RP1  92.44,47.26 270 top
RP_CON0  58.46,23.4 180 top
RP_CON1  73.26,23.4 180 top
RX  73.51,6.95 0 top
SA0  92.44,59.96 270 top
SA1  92.44,57.42 270 top
SA2  92.44,54.88 270 top
SP0  92.44,75.2 270 top
SP1  92.44,72.66 270 top
SP2  92.44,70.12 270 top
SP3  92.44,67.58 270 top
T0  81.6,84.3 270 bottom
T1  81.6,80.5 270 bottom
T2  71.6,84.3 270 bottom
T3  71.6,80.5 270 bottom
T4  61.6,84.3 270 bottom
T5  61.6,80.5 270 bottom
T6  51.6,84.3 270 bottom
T7  51.6,80.5 270 bottom
T9  33.49,64.76 270 bottom
T10  25.51,64.63 90 bottom
TX  70.97,6.95 180 top
U0  84.5,72.9 0 bottom
U1  74.5,72.9 0 bottom
U2  79.2,46.8 90 bottom
U3  64.5,72.9 0 bottom
U4  54.5,72.9 0 bottom
U5  59.2,46.8 90 bottom
U7  40.54,70.71 270 top
U8  20.44,70.71 270 top
U10  73.27,10.84 180 top
U100  30.37,78.99 90 bottom
U$1  69.4,53.6 0 top
U$2  88.6,17.2 270 top
U$4  22.63,38.33 180 bottom
VR0  83.4,37.6 180 top
VR1  73.4,37.6 180 top
VR2  63.4,37.6 180 top
VR3  53.4,37.6 180 top
VR_CON0  63.54,23.4 180 top
VR_CON1  78.34,23.4 180 top

### Tracks (layer width: path | path; a pad name or v marks a point on that pad's centre or on a via)
+3V3  (via drill 0.3)
  Top 0.127: U10.P$1 81.79,4.19 U10.P$2 81.79,5.71 85.22,5.71 90.04,10.54 90.04,22.1 88.65,23.5 U$2.VDD | v77.22,30.1 70.36,36.96 70.36,48.77 70.61,49.02 70.61,53.59 U$1.VCC | JP1.35 2.79,43.05 5.21,43.05 JP1.36 | 5.33,42.93 JP1.36 | v24.27,27.94 20.28,27.94 JP1.36
  Route2 0.127: 3V.TP 91.99,26.94 U$2.VDD
  Bottom 0.127: U$2.VDD 88.52,23.62 82.04,30.1 v77.22,30.1 77.22,28.7 73.41,24.89 72.77,24.89 67.69,19.81 67.69,16.89 C310.1 | 67.69,16.51 67.69,16.76 C310.1 | 67.69,16.51 67.69,12.45 C311.1 67.82,12.32 67.82,7.49 68.33,6.99 3V3.TP | v24.27,27.94 35.69,27.94 47.12,16.51 67.69,16.51 | 67.69,16.51 C310.1
+5V
  Top 0.127: JP1.37 2.79,40.51 5.21,40.51 JP1.38
+12V  (via drill 0.3)
  Top 0.254: 63.25,48.01 63.25,45.53 C61.1 63.25,45.34 v64.2,44.39 | 63.25,48.01 61.91,49.34 C60.1 | 81.72,49.34 C48.1 81.92,49.34 83.25,48.01 83.25,45.53 C49.1 81.27,43.32 v80.08,43.32 | 56.39,71.06 C57.1 56.37,71.08 v56.37,73.53 C56.1 55.05,74.87 | C52.1 64.96,74.87 65.07,74.87 v66.41,73.53 66.41,71 C53.1 | 76.33,73.59 75.06,74.87 C44.1 | 76.33,73.59 76.39,73.53 76.39,71.06 C45.1 | C41.1 86.3,71.06 v86.3,73.53 84.96,74.87 C40.1 | 66.48,70.87 C53.1 | 63.25,48.01 63.24,48 | 63.24,48 63.2,48 | 63.24,48 65.8,48 66.85,49.05 66.85,70.6 C53.1 | v76.35,73.59 76.33,73.59 | 66.8,70.65 C53.1
  Bottom 0.254: C100.2 32.77,82.49 31.62,81.34 31.62,77.92 32.38,77.15 32.77,77.15 U100.8 32.96,76.96 33.53,76.96 37.09,73.4 56.23,73.4 v56.37,73.53 | L2.2 52.96,18.29 56.2,18.29 C301.2 56.39,18.29 56.39,39.62 61.53,44.77 U5.8 61.72,44.77 64.2,44.77 64.39,44.58 | 64.39,44.58 65.72,43.24 80.01,43.24 v80.08,43.32 81.53,44.77 U2.8 | v64.2,44.39 64.39,44.58 | U4.8 56.41,73.57 v56.37,73.53 | U3.8 v66.41,73.53 | v66.41,73.53 v56.37,73.53 | U0.8 86.41,73.75 86.3,73.65 | 86.3,73.65 86.24,73.59 v76.35,73.59 | v76.35,73.59 66.46,73.59 v66.41,73.53 | U1.8 76.41,73.64 v76.35,73.59 | v86.3,73.53 86.3,73.65
+12V_POWER
  Top 0.254: JP1.39 2.86,37.91 5.14,37.91 JP1.40
  Bottom 0.254: R103.2 37.53,67.82 34.67,67.82 Q1.2 34.48,67.63 31.62,67.63 29.72,69.53 24.57,69.53 Q2.2 24.38,69.34 21.72,69.34 R113.2 21.53,69.15 6.48,54.1 6.48,39.05 5.33,37.91 JP1.40 5.33,37.72 5.33,37.34 17.72,24.96 17.72,24.57 C300.2 17.72,24.38 17.72,21.91 L1.1
-12V  (via drill 0.3)
  Top 0.127: 54.48,47.5 v54.4,47.4
  Top 0.254: 74.49,45.72 74.49,49.34 C50.1 74.49,49.53 74.06,49.53 v73.3,50.29 | 74.49,45.72 74.68,45.53 C51.1 74.49,45.72 | 71.42,70.87 71.25,70.87 C47.1 70.65,71.55 C46.1 | 54.48,49.53 C62.1 54.48,49.34 54.48,47.5 54.48,45.72 54.67,45.53 C63.1 54.86,45.34 | 60.58,75.82 C54.1 60.65,71.15 C55.1 60.77,70.87 60.77,69.82 v60.1,69.15 | 50.67,75.82 C58.1 50.65,71.55 C59.1 51.24,70.87 51.24,69.69 v50.7,69.15 | C42.1 80.65,71.55 C43.1 81.15,70.87 81.15,70 v80.3,69.15 | 71.82,70.87 71.42,70.87 | 71.42,70.87 v69.7,69.15
  Bottom 0.254: U100.4 27.81,80.77 27.43,80.77 26.67,80.01 26.67,76.58 27.81,75.44 C101.2 28,75.25 34.67,75.25 39.43,70.48 45.66,70.48 47,69.15 v50.7,69.15 51.75,69.15 52.6,70 U4.4 52.58,70.48 U4.4 52.77,70.29 52.77,69.91 53.53,69.15 v60.1,69.15 61.34,69.15 62.48,70.29 U3.4 62.67,70.29 62.67,69.91 63.44,69.15 v69.7,69.15 72.01,69.15 72.77,69.91 | C302.1 52.2,24.96 50.29,26.86 50.29,32.58 L3.2 50.29,32.77 51.24,33.72 51.24,44.24 v54.4,47.4 55.58,48.58 56.58,48.58 U5.4 56.77,48.77 60.01,48.77 61.53,50.29 v73.3,50.29 76.77,50.29 | 72.77,69.91 72.77,70.29 U1.4 72.77,69.91 | 72.77,69.91 73.53,69.15 78.11,69.15 | 78.11,69.15 v80.3,69.15 81.34,69.15 82.49,70.29 U0.4 | 76.77,50.29 76.77,55.63 78.11,56.96 78.11,69.15 | 76.77,50.29 76.77,48.77 U2.4
DAC0
  Bottom 0.127: R106.1 35.56,76.45 35.81,76.45 36.58,75.69 37.85,75.69 38.35,76.2 38.35,86.5 32.7,92.15 24.97,92.15 9.91,77.09 3.81,77.09 2.79,76.07 JP1.9
DAC1
  Bottom 0.127: R116.2 24.77,76.58 24.26,76.07 24.26,75.95 21.84,73.53 5.33,73.53 JP1.12
FPGA_LED1
  Bottom 0.127: R200.2 2.29,20.7 2.29,22.73 1.02,24 1.02,64.14 2.67,65.79 JP1.17
FPGA_LED2
  Bottom 0.127: R201.2 2.29,24.26 2.29,26.29 1.27,27.3 1.27,63.37 2.54,64.64 4.06,64.64 5.21,65.79 JP1.18
FPGA_LED3
  Bottom 0.127: R202.2 2.29,27.81 2.29,29.72 1.52,30.48 1.52,62.1 2.67,63.25 JP1.19
FPGA_LED4
  Bottom 0.127: R203.2 2.41,31.24 2.41,35.94 3.94,37.47 3.94,61.98 5.21,63.25 JP1.20
GND  (via drill 0.3)
  Top 0.127: C59.2 53.98,71.12 v52.45,72.64 52.45,75.69 C58.2 52.45,75.82 53.59,75.82 53.98,76.2 56.52,76.2 57.66,75.06 C56.2 | C53.2 68.07,71.12 68.07,74.68 67.82,74.93 C52.2 67.69,75.06 67.06,75.06 65.91,76.2 62.74,76.2 62.36,75.82 C54.2 | 58.04,74.68 58.04,71.12 C57.2 | 58.04,74.68 57.78,74.93 C56.2 | C54.2 62.36,72.26 63.5,71.12 C55.2 | 58.04,74.68 C56.2 | C54.2 62.23,75.82 61.47,76.58 59.94,76.58 59.4,77.12 v59.4,77.15 | C47.2 73.91,71.12 72.39,72.64 72.39,75.69 C46.2 72.39,75.82 73.53,75.82 73.91,76.2 76.45,76.2 77.6,75.06 C44.2 | 77.98,74.68 77.72,74.93 C44.2 | 77.98,74.68 78.11,74.55 78.11,71.12 C45.2 | 77.98,74.68 C44.2 | 82.3,75.82 C42.2 82.42,75.69 82.42,72.64 83.95,71.12 C43.2 84.07,70.99 84.96,70.99 85.85,70.1 87.25,70.1 88.14,70.99 C41.2 88.14,71.12 88.14,74.55 87.76,74.93 C40.2 87.76,75.06 87.76,75.95 v90.04,78.23 | 4.06,17.78 4.06,18.67 HV1.P$2 4.06,18.8 4.06,22.1 LED0.P$2 4.06,22.23 4.06,25.65 LED1.P$2 4.06,25.78 4.06,29.08 LED2.P$2 4.06,29.21 4.06,32.64 LED3.P$2 | 4.06,17.78 4.06,15.24 HV0.P$2 | C61.2 65.02,45.34 65.02,44.32 64.39,43.69 v61.85,43.69 59.31,43.69 57.66,45.34 C63.2 57.53,45.47 56.13,46.86 56.13,49.28 C62.2 56.13,49.4 57.4,50.67 62.74,50.67 64.01,49.4 64.52,49.4 C60.2 | U10.P$19 64.64,5.71 64.14,5.71 63.37,6.48 63.37,15.24 64.14,16 64.64,16 U10.P$12 64.77,16 79.88,16 81.28,14.61 81.66,14.61 U10.P$8 81.79,14.48 87.5,14.48 88.52,13.46 U$2.SDO | C51.2 77.6,45.47 76.07,46.99 76.07,49.28 C50.2 75.95,49.4 75.95,50.93 73.28,53.59 U$1.GND | C48.2 84.71,49.28 84.96,49.02 84.96,45.47 C49.2 85.09,45.34 91.82,45.34 GD2.TP
  Top 0.127: U10.P$3 81.66,6.99 78.61,6.99 GND4.TP | v4.7,17.78 4.06,17.78 | 77.98,74.68 79.3,76 v79.3,78.05
  Route15 0.127: v51.7,77.65 50.95,77.65 50.9,77.7 | v62.48,78.11 61.85,78.11 61.8,78.05 | v72.52,78.11 71.7,78.11 71.7,78.1 | v82.55,77.98 81.87,77.98 81.85,78 | v52,20.05 52.55,20.05 52.6,20.1 | v61.25,18.25 61.25,18.85 | v50,62.45 50,63.15 50.1,63.25 | v59.7,60.35 59.7,59.85 59.75,59.8 | v83,52.9 83,53.85 83.05,53.9 | v65.2,72.5 65.55,72.5 | v75.35,72.5 75.35,72.85 | v85.4,72.65 85.4,72.95 | v59.4,77.15 59.4,77.65 | v79.3,78.05 79.95,78.05 | v70.85,13.65 71.5,13.65
  Bottom 0.127: U5.3 56.77,47.5 60.07,47.5 61.21,48.64 61.59,48.64 U5.5 61.72,48.64 69.34,48.64 71.25,46.74 75.69,46.74 76.33,47.37 76.71,47.37 U2.3 76.83,47.5 80.14,47.5 81.28,48.64 81.53,48.64 U2.5 81.53,48.77 81.53,51.43 v83,52.9 | 54.1,70.99 53.98,70.87 53.98,70.48 U4.3 54.1,70.99 | 63.75,70.87 63.75,70.48 U3.3 63.75,70.87 | 73.79,70.87 73.79,70.48 U1.3 73.79,70.87 | 63.75,70.87 65.2,72.31 v65.2,72.5 | 73.79,70.87 75.15,72.23 75.15,72.25 75.35,72.45 v75.35,72.5 | 81.53,65.79 R3.2 81.66,65.91 81.66,67.94 83.82,70.1 83.82,70.36 U0.3 83.82,70.48 83.82,70.87 85.4,72.45 v85.4,72.65 | U$4.P$5 46.74,30.23 46.74,28.19 52.2,22.73 52.2,22.1 C302.2 52.2,21.97 51.94,21.72 51.94,20.11 v52,20.05 | 58.29,18.16 58.93,18.16 C301.1 59.05,18.29 61.21,18.29 v61.25,18.25 | 60.71,60.45 63.25,62.99 63.25,63.37 R22.2 | 60.71,60.45 60.71,56.9 GUARD4.TP | 46.86,66.67 GUARD2.TP 46.74,66.67 44.2,66.67 40.64,63.12 U7.P$6 40.51,62.99 34.67,62.99 | 53.47,63.37 R32.2 53.34,63.37 52.45,62.48 50.03,62.48 v50,62.45 | C300.1 17.78,27.3 18.41,27.3 21.34,30.23 U$4.P$2 21.46,30.35 21.46,35.31 U$4.P$3 21.34,35.43 21.34,37.59 15.88,43.05 J6.P$2 | 51.69,75.44 48.13,75.44 46.86,76.71 GUARD1.TP | 51.69,75.44 52.58,75.44 U4.5 | 52.58,81.15 52.58,81.41 T7.B 52.7,81.53 52.7,83.31 T6.E 52.58,83.44 49.66,83.44 46.86,86.23 46.86,86.74 GUARD0.TP 46.74,86.74 43.94,86.74 40.64,83.44 U7.P$2 | R12.2 73.41,63.37 73.41,61.59 74.04,60.96 74.04,60.71 74.55,60.2 74.55,57.91 75.56,56.9 GUARD5.TP 75.56,56.77 75.56,56.01 73.28,53.72 U$1.GND | v82.55,77.98 82.55,75.44 U0.5 | 82.68,81.41 T1.B 82.68,81.53 82.68,83.31 T0.E 82.68,83.44 81.53,84.58 81.53,84.96 78.74,87.76 76.58,87.76 J1.S1
  Bottom 0.127: v72.52,78.11 72.52,75.44 U1.5 | 72.64,81.41 T3.B 72.64,81.53 72.64,83.31 T2.E 72.64,83.44 71.5,84.58 71.5,84.96 68.71,87.76 66.55,87.76 J2.S1 | v62.48,78.11 62.48,75.44 U3.5 | 62.61,81.41 T5.B 62.74,81.53 62.74,83.31 T4.E 62.61,83.44 62.61,83.69 61.59,84.71 61.59,84.84 58.67,87.76 56.64,87.76 J3.S1 | R111.1 26.04,61.09 26.04,63.5 25.53,64.01 25.53,64.52 24.51,65.53 T10.E 24.38,65.53 22.86,65.53 20.45,63.12 U8.P$6 | 69.47,14.1 69.47,15.88 70.36,16.76 C310.2 | 69.47,14.1 69.47,12.45 C311.2 | 34.67,62.99 34.67,63.75 T9.E | 34.67,62.99 34.67,61.21 R101.1 | v26.8,73.53 27.81,73.53 C101.1 | R115.2 23.11,82.3 21.46,82.3 20.45,83.31 U8.P$2 | C100.1 32.77,84.33 32.77,87.25 31.62,88.39 U7.P$9 | v35.56,81.28 35.56,82.55 R105.2 | GUARD3.TP 46.86,56.77 46.86,53.72 47.5,53.09 U7.P$8 | GD1.TP 90.04,54.74 90.04,56.77 GUARD6.TP | GND0.TP 90.81,66.67 90.04,66.67 GUARD7.TP | v90.04,78.23 90.04,76.83 GUARD8.TP | GUARD9.TP 89.92,86.87 87.5,86.87 86.61,87.76 J0.S1 | 78.49,6.99 GND4.TP | 63.63,28.32 HV_VR0.3 | v52.45,72.64 54.1,70.99 | 51.69,75.44 51.69,77.64 v51.7,77.65 | 60.71,60.45 59.8,60.45 v59.7,60.35 | 69.47,14.1 69.92,13.65 v70.85,13.65
  pour Route15 (rank 2): 37.65,46.65 37.65,43.45 41.2,39.65 47,39.65 47,46.85 43.5,46.85 43.5,58.5 37.65,58.5 37.65,46.85 23.5,46.85 23.5,58.5 17.65,58.5 17.65,43.6 21.6,39.65 27,39.65 27,46.65 30.65,46.65 30.65,-2.1 -4.5,-2.1 -4.5,99.15 98.3,99.15 98.15,-2.05 30.85,-2.05 30.85,46.65
GPS_1PPS  (via drill 0.3)
  Top 0.127: 70.36,10.92 72.9,8.38 74.55,8.38 | 70.36,10.92 66.8,14.48 64.77,14.48 U10.P$13 | 74.55,8.38 75.95,6.99 1PPS_IN.TP | 70.36,10.92 67.06,7.62 67.06,4.45 65.79,3.17 63.75,3.17 63.12,3.81 63.12,10.16 58.04,15.24 41.4,15.24 12.57,44.07 2.54,44.07 1.4,45.21 1.4,68.58 2.67,69.85 2.67,70.87 JP1.13 | v80.14,14.22 80.14,13.97 74.55,8.38
  Bottom 0.127: v80.14,14.22 88.14,22.23 89.67,22.23 90.4,22.95 90.4,27.44 1P.TP
GPS_RX_FPGA_TX  (via drill 0.3)
  Top 0.127: v77.6,26.8 77.47,26.67 57.91,26.67 44.7,39.88 40.72,39.88 37.97,42.63 37.97,58.29 35.18,61.09 20.83,61.09 13.59,68.33 5.33,68.33 JP1.16
  Bottom 0.127: RX.TP 73.53,6.86 74.93,5.46 79.12,5.46 80.01,6.35 80.01,11.05 76.71,14.35 76.71,16.64 R301.2 76.71,16.76 77.47,16.76 79.76,19.05 79.76,24 77.6,26.16 v77.6,26.8
GPS_TX_FPGA_RX  (via drill 0.3)
  Top 0.127: v67.82,4.57 68.58,4.57 70.87,6.86 TX.TP
  Bottom 0.127: R300.2 76.71,12.32 76.71,11.94 73.15,8.38 72.39,8.38 70.99,6.99 TX.TP | v67.82,4.57 66.55,3.3 43.69,3.3 35.18,11.81 2.16,11.81 0.76,13.21 0.76,65.41 2.67,67.31 2.67,68.33 JP1.15
HV_POWER0  (via drill 0.3)
  Top 0.127: v38.99,78.99 29.97,78.99 v24.89,73.91
  Bottom 0.127: 24.89,70.36 30.73,70.36 32.38,68.71 Q1.3 | 24.89,70.36 17.65,70.36 17.27,69.98 17.27,68.58 5.71,57.02 5.08,57.02 4.19,56.13 4.19,37.34 5.71,35.81 5.71,16.89 4.57,15.75 3.68,15.75 2.41,14.48 2.41,13.21 R104.2 | v38.99,78.99 38.99,83.57 40.51,85.09 40.51,85.85 U7.P$1 | 24.89,70.36 v24.89,73.91
HV_POWER1  (via drill 0.3)
  Top 0.127: v5.08,20.19 5.08,36.07 v7.11,38.1
  Bottom 0.127: v5.08,20.19 4.7,19.81 4.19,19.81 2.41,18.03 2.41,16.76 R114.2 | v7.11,38.1 7.11,54.23 19.43,66.55 25.15,66.55 26.67,68.07 | 26.67,68.07 26.67,68.45 Q2.3 26.67,68.07 | 26.67,68.07 27.94,66.8 38.23,66.8 38.61,67.18 38.61,68.45 38.35,68.71 33.78,68.71 33.53,68.96 33.53,69.47 28.57,74.42 27.18,74.42 26.29,75.31 26.29,76.71 25.4,77.6 24.26,77.6 24,77.34 24,76.07 23.75,75.82 22.48,75.82 22.23,76.07 22.23,78.23 20.95,79.5 20.19,79.5 19.3,80.39 19.3,83.95 20.32,84.96 20.32,85.85 U8.P$1
HV_REF0  (via drill 0.3)
  Top 0.127: v36.2,78.11 36.2,69.85 53.21,52.83 53.21,43.69 v57.4,39.5
  Bottom 0.127: 36.2,78.36 36.96,79.12 37.21,79.12 R107.1 | 36.2,78.36 32.89,78.36 U100.7 | v36.2,78.11 36.2,78.36 | v57.4,39.5 57.4,24.51 58.42,23.5 RP_CON0.TP
HV_REF1  (via drill 0.3)
  Route2 0.127: v31.37,82.04 40.89,82.04 56.39,66.55 56.39,43.43 73.15,26.67 73.15,23.5 RP_CON1.TP
  Bottom 0.127: 29.59,81.53 27.94,83.19 24.26,83.19 24,82.93 24,81.53 23.11,80.64 23.11,79.12 R117.2 | 29.59,81.53 29.59,78.49 28.19,77.09 U100.1 | v31.37,82.04 30.1,82.04 29.59,81.53
LED0  (via drill 0.3)
  Top 0.127: v3.17,22.99 2.41,22.23 LED0.P$1
  Bottom 0.127: v3.17,22.99 3.17,21.46 3.94,20.7 R200.1
N$2
  Bottom 0.127: U0.6 83.86,79.61 R0.2 C0.1 84.7,83.9 84,84.6 | J0.1 84,85.6 | 84,85.6 84,84.6 | 84,84.6 84,80.85 T1.E | T0.B 83.65,85.25 84,85.6
N$3
  Top 0.127: RP0.TP 94.11,48.13 94.11,25.91 93,24.8 91.5,24.8 90.39,25.91 57.91,25.91 44.45,39.37 21.63,39.37 17.8,43.2 17.8,45.4 16.34,46.86 4.83,46.86 3.68,48.01 2.79,48.01 JP1.31
N$4
  Bottom 0.127: 85.14,76.45 85.14,79.19 R0.1 C0.2 87.38,83.95 88.77,85.34 92.33,85.34 PA0.TP | 85.14,76.45 U0.7 | R1.2 87.25,63.5 87.25,65.79 C1.1 87.12,65.91 87.12,76.2 86.87,76.45 85.14,76.45 | 85.09,76.45 85.14,76.45
N$5
  Bottom 0.127: U2.6 81.66,47.37 82.04,47.37 84.2,45.21 84.2,38.48 83.44,37.72 VR0.2
N$6
  Bottom 0.127: R1.1 85.34,63.37 83.44,63.37 R2.2 83.44,63.5 83.44,65.79 R3.1 83.44,65.91 85.34,65.91 C1.2
N$7
  Bottom 0.127: 81.66,60.83 81.66,63.37 R2.1 81.66,63.5 82.55,64.39 82.55,66.67 85.09,69.22 85.09,70.36 U0.2 | 81.66,60.83 81.66,59.94 R4.1 | 81.66,60.83 83.95,60.83 84.84,59.94 85.34,59.94 C2.1
N$8  (via drill 0.3)
  Top 0.127: v86.49,62.23 v86.49,66.93 | v84.2,46.35 84.2,44.7 83.44,43.94 83.44,40.26 VR0.1
  Bottom 0.127: 84.71,59.05 83.95,59.82 83.44,59.82 R4.2 | 84.71,59.05 86.36,59.05 87.12,59.82 C2.2 87.12,59.94 86.49,60.58 v86.49,62.23 | v86.49,66.93 86.49,70.36 U0.1 | v84.2,46.35 84.2,58.55 84.71,59.05
N$9
  Bottom 0.127: 84.07,35.81 83.44,35.18 VR0.3 | 84.07,35.81 87.25,38.99 87.25,45.09 86.49,45.85 R5.1 86.49,45.97 88.01,47.5 88.01,70.23 92.33,74.55 92.33,75.18 SP0.TP | 84.07,35.81 82.55,37.34 82.55,40.39 82.8,40.64 82.8,45.34 82.04,46.1 81.66,46.1 U2.7
N$10
  Bottom 0.127: J1.1 74,85.6 | 74,85.6 74,84.6 | 74,84.6 74,80.85 T3.E | T2.B 73.65,85.25 74,85.6 | 74,84.6 74.7,83.9 C10.1 R10.2 73.86,79.61 U1.6
N$11  (via drill 0.3)
  Top 0.127: 79.12,66.93 85.6,66.93 91.06,72.39 91.06,81.53 92.33,82.8 PA1.TP | 79.12,66.93 v77.22,66.93 | 79.12,66.93 v79.12,74.3
  Bottom 0.127: C10.2 R10.1 75.14,79.19 75.14,76.45 | 75.14,76.45 U1.7 | R11.2 77.22,63.5 77.22,65.79 C11.1 77.22,65.91 v77.22,66.93 | 75.14,76.45 76.96,76.45 v79.12,74.3
N$12
  Bottom 0.127: 71.75,64.64 71.75,65.79 R13.2 | 71.75,64.64 71.75,63.5 R12.1 | 75.56,64.64 75.56,65.79 C11.2 | 75.56,64.64 75.56,63.5 R11.1 | 75.56,64.64 71.75,64.64
N$13  (via drill 0.3)
  Top 0.127: v72.52,60.96 v74.68,60.96 | v76.83,68.45 v78.23,69.85
  Bottom 0.127: 71.63,60.96 71.63,61.85 70.74,62.74 70.74,66.55 70.99,66.8 72.39,66.8 73.28,65.91 R13.1 73.41,65.91 75.95,68.45 v76.83,68.45 | 71.63,60.96 71.63,59.94 R14.1 | v74.68,60.96 75.44,60.2 75.44,59.94 C12.1 | 71.63,60.96 v72.52,60.96 | v78.23,69.85 78.23,70.23 76.83,71.63 75.95,71.63 75.18,70.87 75.18,70.48 U1.2
N$14  (via drill 0.3)
  Top 0.127: v77.34,69.85 76.2,68.71 v76.2,64.77 | v72.01,52.32 72.01,50.67 73.28,49.4 73.28,40.26 VR1.1
  Bottom 0.127: 75.31,61.72 77.09,59.94 C12.2 | 75.31,61.72 74.55,62.48 74.55,63.75 74.04,64.26 72.64,64.26 72.52,64.14 72.52,62.1 73.28,61.34 73.28,59.94 R14.2 73.28,59.82 72.01,58.55 v72.01,52.32 | v77.34,69.85 76.83,70.36 76.45,70.36 U1.1 | v76.2,64.77 76.2,64.14 76.33,64.01 76.33,62.74 75.31,61.72
N$15  (via drill 0.3)
  Top 0.127: v36.45,45.97 36.45,47.12 24.26,59.31 4.83,59.31 3.81,58.29 2.79,58.29 JP1.23 | FP2.TP 92.33,37.08 84.71,29.46 75.69,29.46 74.93,28.7 74.93,28.57 73.66,27.3 57.9,27.3 47.14,38.06 v47.14,39.63
  Bottom 0.127: v36.45,45.97 36.45,45.47 37.52,44.4 37.75,44.4 37.75,43.3 41.42,39.63 v47.14,39.63
N$16  (via drill 0.3)
  Top 0.127: v37.47,41.42 37.47,46.48 24.38,59.56 4.83,59.56 3.68,60.71 2.79,60.71 JP1.21
  Bottom 0.127: v37.47,41.42 37.47,26.54 47.24,16.76 62.99,16.76 80.26,34.04 84.2,34.04 92.33,42.16 FP0.TP
N$17  (via drill 0.3)
  Top 0.127: v77.98,43.94 77.98,42.29 73.41,37.72 VR1.2
  Bottom 0.127: v77.98,43.94 77.98,45.21 77.09,46.1 76.83,46.1 U2.2
N$18  (via drill 0.3)
  Top 0.127: 70.99,44.96 70.99,37.47 73.28,35.18 VR1.3 | 70.99,44.96 v70.99,48.51 | 70.99,44.96 v72.64,44.96
  Bottom 0.127: v70.99,48.51 71.12,48.51 71.88,49.28 R15.1 | v72.64,44.96 76.71,44.96 U2.1 | SP1.TP 92.33,72.64 92.33,72.01 88.27,67.94 88.27,38.86 83.69,34.29 74.17,34.29 VR1.3
N$19
  Top 0.127: JP1.7 2.79,78.61 3.81,78.61 4.83,79.63 65.28,79.63 69.22,75.69 69.22,69.6 69.09,69.47 69.09,68.83 77.85,60.07 92.33,60.07 SA0.TP
N$20  (via drill 0.3)
  Top 0.127: v65.53,66.93 61.98,70.48 61.98,74.04 v61.72,74.3 | v69.34,85.85 70.23,86.74 93.09,86.74 93.85,85.98 93.85,82.17 92.46,80.77 92.46,80.39 PA2.TP
  Bottom 0.127: 66.04,66.42 66.42,66.8 67.82,66.8 68.07,66.55 68.07,64.39 67.18,63.5 R21.2 | 66.04,66.42 65.53,65.91 C21.1 | v65.53,66.93 66.04,66.42 | v61.72,74.3 62.1,74.3 62.23,74.17 64.26,74.17 65.02,74.93 65.02,75.31 U3.7 65.14,79.19 R20.1 C20.2 67.44,83.95 v69.34,85.85
N$21
  Bottom 0.127: R22.1 61.72,63.5 61.72,64.26 63.25,65.79 R23.2 63.37,65.79 64.01,65.79 65.53,64.26 | 65.53,64.26 65.53,63.5 R21.1 | 65.53,64.26 67.06,65.79 C21.2
N$22  (via drill 0.3)
  Top 0.127: v68.58,69.85 68.58,68.83 v68.2,68.45
  Bottom 0.127: 64.26,60.83 64.52,60.83 65.41,59.94 C22.1 | 64.26,60.83 62.61,60.83 61.72,59.94 R24.1 | 64.26,60.83 64.26,64.01 64.01,64.26 62.74,64.26 62.48,64.01 62.48,62.74 62.23,62.48 61.09,62.48 60.83,62.74 60.83,64.14 61.59,64.9 61.59,65.79 R23.1 61.72,65.91 64.26,68.45 v68.2,68.45 | v68.58,69.85 66.8,71.63 66.04,71.63 65.15,70.74 65.15,70.48 U3.2
N$23  (via drill 0.3)
  Top 0.127: v67.56,69.85 v67.56,62.23 69.34,60.45 69.34,48.13 63.5,42.29 63.5,40.26 VR2.1
  Bottom 0.127: R24.2 63.37,59.82 64.01,59.82 64.77,59.05 66.29,59.05 67.06,59.82 C22.2 67.18,59.94 67.56,60.33 v67.56,62.23 | v67.56,69.85 67.06,70.36 66.42,70.36 U3.1
N$24
  Bottom 0.127: U3.6 63.87,79.61 R20.2 C20.1 65.55,84 64.8,84 64,84.8 | J2.1 64,85.6 | 64,85.6 64,84.8 | T4.B 63.65,85.25 64,85.6 | T5.E 64,80.85 64,84.8
N$25  (via drill 0.3)
  Top 0.127: v86.5,54.65 79.7,54.65 v79.6,54.75 | v63.85,56.9 63.05,57.7 v54.35,57.7
  Route2 0.127: SA1.TP 89.67,54.65 v86.5,54.65 | v79.6,54.75 77.45,56.9 v63.85,56.9 | JP1.8 7.26,78.51 18.9,90.15 21.55,90.15 23.65,88.05 23.65,84.5 50.45,57.7 v54.35,57.7
  Bottom 0.127: 5.33,78.61 JP1.8
N$26  (via drill 0.3)
  Top 0.127: v58.93,43.18 58.93,42.16 63.37,37.72 VR2.2
  Bottom 0.127: v58.93,43.18 58.93,45.09 61.21,47.37 61.59,47.37 U5.6
N$27  (via drill 0.3)
  Top 0.127: v67.44,45.09 67.44,40.51 63.5,36.58 63.5,35.18 VR2.3
  Route2 0.127: v67.44,45.09 68.07,45.72 73.79,45.72 89.41,61.34 93.09,61.34 93.73,61.98 93.73,68.2 92.46,69.47 92.46,70.1 SP2.TP
  Bottom 0.127: U5.7 61.72,46.1 61.85,45.97 66.29,45.97 R25.1 66.42,45.85 67.18,45.09 v67.44,45.09
N$28
  Bottom 0.127: T7.E 54,80.85 54,84.6 | 54,84.6 54.7,83.9 C30.1 R30.2 53.87,79.61 U4.6 | J3.1 54,85.6 | 54,85.6 54,84.6 | T6.B 53.65,85.25 54,85.6
N$29  (via drill 0.3)
  Top 0.127: v57.78,66.93 57.78,68.58 59.05,69.85 v59.05,74.3
  Route2 0.127: PA3.TP 91.08,79.1 59.75,79.1 59.35,78.7 v59.25,78.7
  Bottom 0.127: R30.1 C30.2 57.28,83.95 | R30.1 55.13,79.19 55.13,76.45 | 55.13,76.45 U4.7 | 57.78,66.8 56.39,66.8 55.5,65.91 C31.1 | 57.78,66.8 58.04,66.55 58.04,64.39 57.15,63.5 R31.2 | v57.78,66.93 57.78,66.8 | v59.05,74.3 56.9,76.45 55.13,76.45 | 55.12,76.45 55.13,76.45 | v59.25,78.7 57.35,80.6 R30.1
N$30
  Bottom 0.127: 53.34,65.15 51.69,63.5 R32.1 | 53.34,65.15 53.34,65.79 R33.2 | 53.34,65.15 54.99,63.5 55.37,63.5 R31.1 55.5,63.5 57.15,65.15 C31.2
N$31  (via drill 0.3)
  Top 0.127: v52.07,61.85 51.69,62.23 v51.69,64.52 52.83,64.52 v58.17,69.85
  Bottom 0.127: 52.32,61.59 51.69,60.96 51.69,59.94 R34.1 | 52.32,61.59 53.72,61.59 55.37,59.94 C32.1 | v51.69,64.52 51.69,65.79 R33.1 | 52.32,61.59 v52.07,61.85 | v58.17,69.85 58.17,70.23 56.77,71.63 56.01,71.63 55.24,70.87 55.24,70.48 U4.2
N$32  (via drill 0.3)
  Top 0.127: v57.28,69.98 56.26,69.98 51.05,64.77 51.05,61.98 52.07,60.96 v52.58,60.96 53.47,60.07 53.47,44.58 53.85,44.2 v53.85,43.94
  Bottom 0.127: C32.2 57.15,59.82 56.39,59.05 54.74,59.05 53.98,59.82 53.47,59.82 R34.2 53.34,59.94 52.58,60.71 v52.58,60.96 | v57.28,69.98 56.9,70.36 56.52,70.36 U4.1 | v53.85,43.94 53.47,43.56 53.47,40.26 VR3.1
N$33
  Top 0.127: JP1.10 5.21,75.95 4.32,75.95 3.17,74.8 2.29,74.8 1.14,75.95 1.14,83.57 2.54,84.96 3.17,84.96 4.19,85.98 4.19,86.61 4.83,87.25 9.53,87.25 10.54,86.23 19.05,86.23 19.94,87.12 29.72,87.12 30.61,86.23 39.12,86.23 40.01,87.12 50.8,87.12 53.09,84.84 62.99,84.84 71.5,76.33 71.5,72.9 72.9,71.5 72.9,67.18 78.74,61.34 93.09,61.34 93.85,60.58 93.85,56.39 92.46,54.99 SA2.TP
N$34
  Top 0.127: FP1.TP 93.85,38.23 93.85,26.15 92.9,25.2 91.5,25.2 90.54,26.16 58.04,26.16 44.58,39.62 40.53,39.62 37.72,42.43 37.72,58.17 35.05,60.83 5.33,60.83 JP1.22
N$35
  Bottom 0.127: U5.2 56.64,46.1 56.39,46.1 54.48,44.2 54.48,38.73 53.47,37.72 VR3.2
N$36  (via drill 0.3)
  Top 0.127: v50.93,48.39 50.93,37.59 53.34,35.18 VR3.3
  Route2 0.127: v59.82,46.86 74.55,46.86 87.25,59.56 87.25,63.88 90.93,67.56 92.33,67.56 SP3.TP
  Bottom 0.127: v50.93,48.39 51.05,48.39 51.94,49.28 R35.1 | VR3.3 53.47,35.18 54.23,35.94 54.23,37.97 56.64,40.39 56.64,44.83 U5.1 56.77,44.96 57.15,44.96 59.05,46.86 v59.82,46.86
N$37
  Bottom 0.127: R102.1 40.64,69.47 41.53,68.58 41.53,67.18 40.89,66.55 33.78,66.55 32.51,65.28 32.51,64.77 T9.C
N$38
  Bottom 0.127: Q1.1 34.67,69.6 37.59,69.6 R103.1 37.72,69.47 37.97,69.47 39.5,67.94 40.51,67.94 R102.2
N$39
  Bottom 0.127: R100.2 32.89,57.91 32.89,61.09 R101.2 32.89,61.21 33.4,61.72 33.4,64.26 34.54,65.41 34.54,65.66 T9.B
N$40  (via drill 0.3)
  Top 0.127: v17.91,66.55 25.53,66.55 v26.42,65.66
  Bottom 0.127: v17.91,66.55 18.16,66.8 18.16,67.56 R112.1 | v26.42,65.66 26.42,64.77 26.54,64.64 T10.C
N$41  (via drill 0.3)
  Top 0.127: v19.3,68.33 20.45,67.18 v20.57,67.18
  Bottom 0.127: v19.3,68.33 18.29,69.34 R112.2 | v20.57,67.18 21.21,67.18 21.59,67.56 R113.1 21.72,67.56 24.38,67.56 Q2.1
N$42  (via drill 0.3)
  Top 0.127: v3.17,14.35 2.41,15.11 HV0.P$1
  Bottom 0.127: v3.17,14.35 3.17,13.97 3.94,13.21 R104.1
N$43
  Bottom 0.127: R110.2 24.38,57.91 24.38,60.96 R111.2 24.38,61.09 24.38,63.63 T10.B
N$44  (via drill 0.3)
  Top 0.127: v3.17,17.91 2.41,18.67 HV1.P$1
  Bottom 0.127: v3.17,17.91 3.17,17.53 3.94,16.76 R114.1
N$45
  Bottom 0.127: U100.6 32.89,79.5 33.15,79.25 35.43,79.25 R107.2 35.56,79.25 37.21,80.9 37.21,82.55 R105.1
N$46
  Route2 0.406: U7.P$7 40.54,46.18 J5.P$1
N$47
  Bottom 0.127: R106.2 37.34,76.58 37.34,77.85 38.1,78.61 38.1,83.31 37.85,83.57 34.92,83.57 33.66,82.3 33.66,81.66 32.89,80.9 U100.5
N$48
  Route2 0.406: U8.P$7 20.44,46.13 J6.P$1
N$49
  Bottom 0.127: 24.89,81.79 24.89,82.17 R115.1 24.89,81.79 | 24.89,81.79 24.89,79.12 R117.1 | 24.89,81.79 28.96,81.79 29.34,81.41 29.34,79.5 28.19,78.36 U100.2
N$50
  Bottom 0.127: R116.1 23.24,76.71 23.24,76.96 24.51,78.23 25.4,78.23 26.29,79.12 26.29,80.9 26.92,81.53 28.83,81.53 29.08,81.28 29.08,80.52 28.19,79.63 U100.3
N$52
  Bottom 0.254: U$4.P$7 48.55,18.27 L2.1
N$53
  Bottom 0.254: U$4.P$4 49.22,35.4 L3.1
N$54
  Bottom 0.127: L1.2 17.78,20.19 21.34,20.19 U$4.P$1
N$55
  Route2 0.127: HV_VR0.1 58.42,28.45 58.42,29.21 55.5,32.13 55.5,63.37 40.64,78.23 U7.P$4
N$57  (via drill 0.3)
  Top 0.127: v76.83,27.3 75.82,28.32 HV_VR1.2
  Bottom 0.127: v76.83,27.3 76.83,24.89 78.23,23.5 VR_CON1.TP
N$58  (via drill 0.3)
  Top 0.127: v8.89,52.32 8.89,54.23 5.33,57.78 5.33,58.17 JP1.24
  Bottom 0.127: v8.89,52.32 23.5,37.72 23.5,23.88 35.56,11.81 61.59,11.81 68.2,5.21 79.25,5.21 87.38,13.34 87.38,18.92 88.27,19.81 89.15,19.81 93.85,24.51 93.85,33.15 FP3.TP
N$64  (via drill 0.3)
  Top 0.127: v77.47,17.65 81.66,17.65 U10.P$10
  Bottom 0.127: v77.47,17.65 75.82,17.65 74.93,16.76 R301.1
N$65  (via drill 0.3)
  Top 0.127: v78.36,16.64 81.15,16.64 81.66,16.13 U10.P$9
  Route2 0.127: v78.36,16.64 v75.18,13.46
  Bottom 0.127: v75.18,13.46 75.18,12.45 R300.1
N$66  (via drill 0.3)
  Top 0.127: v3.17,33.53 2.41,32.77 LED3.P$1
  Bottom 0.127: v3.17,33.53 3.17,32 3.94,31.24 R203.1
N$67  (via drill 0.3)
  Top 0.127: v3.17,29.97 2.41,29.21 LED2.P$1
  Bottom 0.127: v3.17,29.97 3.17,28.57 R202.1
N$68  (via drill 0.3)
  Top 0.127: v3.17,26.54 2.41,25.78 LED1.P$1
  Bottom 0.127: v3.17,26.54 3.17,25.02 3.94,24.26 R201.1
N$69
  Bottom 0.127: HV_VR0.2 61.09,28.32 61.09,25.91 63.5,23.5 VR_CON0.TP
N$70
  Route2 0.127: JP1.32 5.33,48.01 7.11,48.01 33.27,21.84 78.61,21.84 91.06,34.29 91.06,45.97 92.33,47.24 RP1.TP
N$73
  Top 0.127: HV_VR1.1 73.15,28.45 67.56,28.45 51.82,44.2 51.82,53.85 31.5,74.17 26.04,74.17 25.15,73.28 24.64,73.28 20.45,77.47 20.45,78.23 U8.P$4
PREAMP_OUT0  (via drill 0.3)
  Top 0.127: v69.98,72.9 69.98,74.8 69.47,75.31 69.47,75.82 60.71,84.58 6.22,84.58 5.33,83.69 JP1.4
  Route2 0.127: v84.84,58.17 70.1,72.9 v69.98,72.9
  Bottom 0.127: v84.84,58.17 84.84,45.85 86.36,44.32 R5.2
PREAMP_OUT1  (via drill 0.3)
  Top 0.127: v66.17,49.53 66.17,50.04 v61.98,54.23 | v50.16,54.23 49.4,54.23 47.88,55.75 45.09,55.75 28.19,72.64 10.16,72.64 5.71,77.09 2.16,77.09 1.4,77.85 1.4,82.3 2.67,83.57 JP1.3
  Bottom 0.127: v66.17,49.53 68.83,49.53 70.61,47.75 71.88,47.75 R15.2 | v50.16,54.23 v61.98,54.23
PREAMP_OUT2  (via drill 0.3)
  Top 0.127: v68.07,43.94 68.07,34.67 74.04,28.7 74.04,28.07 73.53,27.56 68.07,27.56 51.56,44.07 51.56,53.72 32.38,72.9 10.29,72.9 5.84,77.34 2.29,77.34 1.65,77.98 1.65,81.53 2.54,82.42 3.17,82.42 4.19,83.44 4.19,85.09 5.21,86.11 JP1.2
  Bottom 0.127: v68.07,43.94 67.82,44.2 66.42,44.2 R25.2
PREAMP_OUT3  (via drill 0.3)
  Top 0.127: v30.73,70.99 v45.34,56.39
  Bottom 0.127: v45.34,56.39 45.34,51.94 49.53,47.75 51.94,47.75 R35.2 | v30.73,70.99 28.45,70.99 25.53,73.91 25.53,74.17 25.15,74.55 23.24,74.55 20.95,72.26 4.83,72.26 3.81,73.28 3.81,73.91 2.92,74.8 2.29,74.8 1.65,75.44 1.65,85.09 2.67,86.11 JP1.1
RASPI_HV0  (via drill 0.3)
  Top 0.127: v7.75,53.09 6.86,53.09 5.46,51.69 3.81,51.69 2.79,50.67 JP1.29
  Bottom 0.127: v7.75,53.09 12.45,53.09 17.4,58.04 23.11,58.04 23.24,57.91 23.24,57.15 24.26,56.13 33.02,56.13 34.04,57.15 34.04,57.28 34.54,57.78 R100.1
RASPI_HV1  (via drill 0.3)
  Top 0.127: v25.65,56.77 24.26,56.77 22.86,58.17 15.62,58.17 8.13,50.67 5.33,50.67 JP1.30
  Bottom 0.127: v25.65,56.77 26.04,57.15 26.04,57.78 R110.1
SCL  (via drill 0.3)
  Top 0.127: v8,54.23 4.83,54.23 3.81,53.21 2.79,53.21 JP1.27 | v44.2,37.08 55.88,25.4 63.5,25.4 66.93,21.97 79.38,21.97 86.61,14.73 89.03,14.73 89.79,13.97 89.79,12.83 88.65,11.68 88.65,10.92 U$2.SCK
  Bottom 0.127: v8,54.23 13.21,54.23 17.27,58.29 23.24,58.29 23.5,58.04 23.5,57.28 23.75,57.02 25.02,57.02 25.15,57.15 25.15,58.55 25.4,58.8 30.48,58.8 32.26,57.02 33.53,57.02 33.78,57.28 33.78,58.55 34.04,58.8 35.81,58.8 | 35.81,58.8 56.39,58.8 60.33,54.86 66.93,54.86 68.07,53.72 U$1.SCL | 35.81,58.8 35.81,45.72 37.47,44.07 37.47,42.84 43.22,37.08 v44.2,37.08
SDA  (via drill 0.3)
  Top 0.127: JP1.28 5.21,53.09 4.32,53.09 2.92,51.69 2.29,51.69 1.65,51.05 1.65,47.5 2.54,46.61 15.11,46.61 17.45,44.27 17.45,42.25 20.96,38.73 v43.43,38.73 43.94,38.73 57.02,25.65 78.11,25.65 85.22,18.54 88.52,18.54 U$2.CSB
  Bottom 0.127: U$1.SDA 65.53,53.59 59.69,53.59 49,42.9 49,40 47.73,38.73 v43.43,38.73
TP1
  Route2 0.127: U7.P$3 40.64,80.77 41.27,80.77 56.13,65.91 56.13,31.88 60.96,27.05 60.96,23.5 HV_JP0.TP
TP2
  Route2 0.127: U8.P$3 20.45,80.77 20.45,79.88 25.65,74.68 25.65,59.55 31.5,53.7 31.5,44.1 53.5,22.1 74.42,22.1 75.69,23.37 HV_JP1.TP

### Text on the board
Top: GROWTH | DAUGHTER | BOARD | Rev 1.0
Bottom: U6